# Altium project MainBoard.PrjPCB (part 1 of 2)
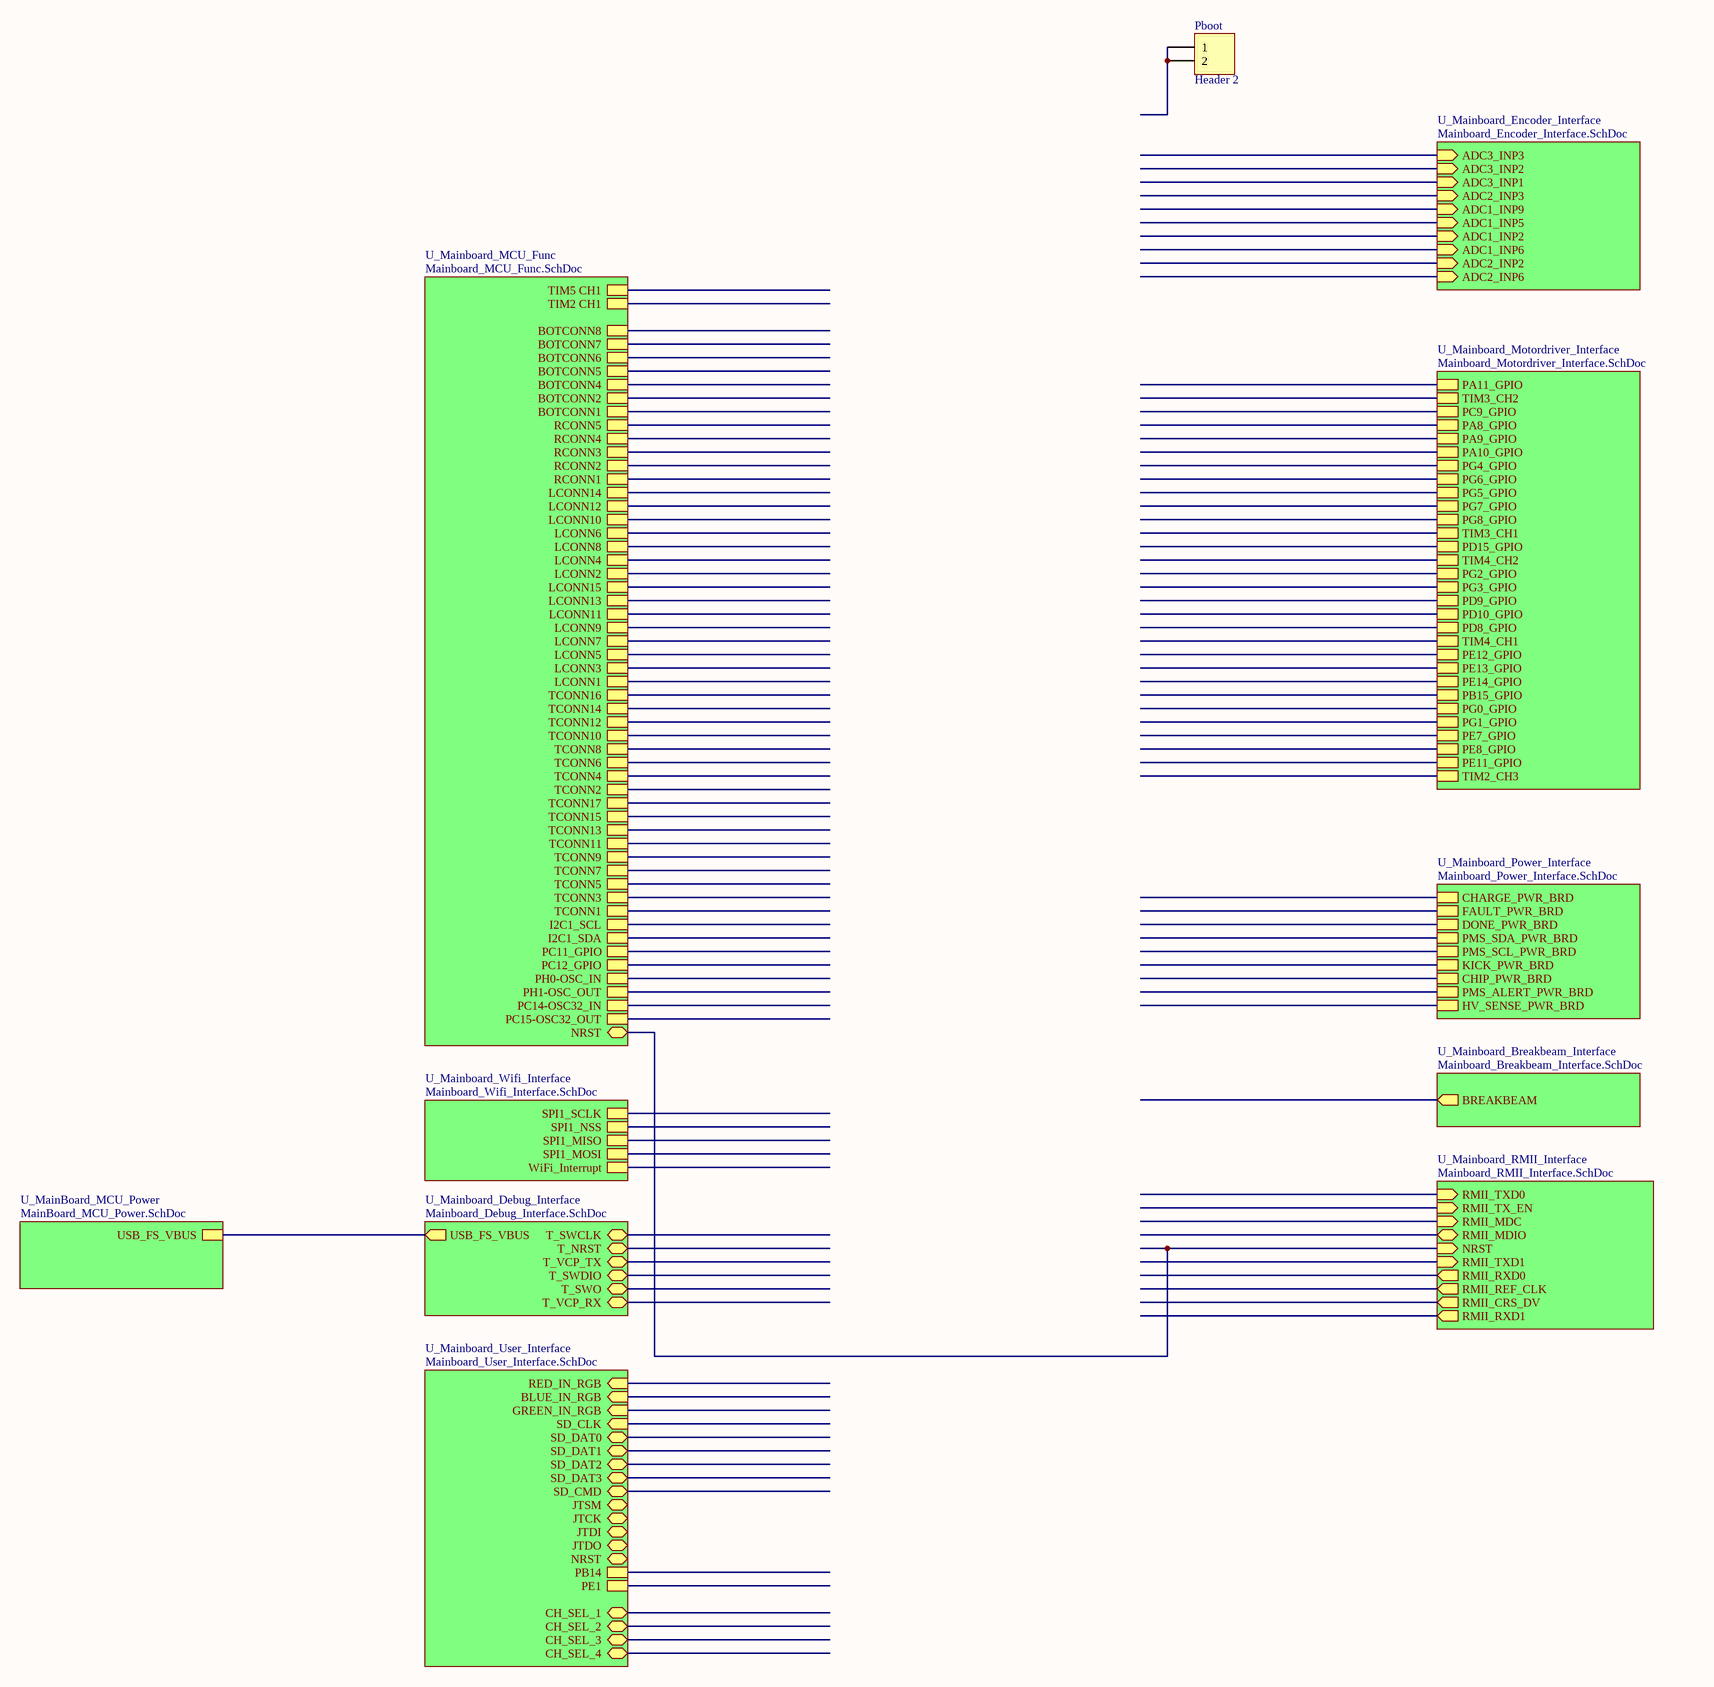
[diagram p0: MainBoard_Top.SchDoc]
12 sheets, 219 parts. Net scope: hierarchical (ports join the sheet entries above them; power ports are global).
Board file: MainBoard_Layout_V2.PcbDoc
Sheets:
  MainBoard_Top.SchDoc
    U_Mainboard_Encoder_Interface = Mainboard_Encoder_Interface.SchDoc
    U_Mainboard_MCU_Func = Mainboard_MCU_Func.SchDoc
    U_Mainboard_Motordriver_Interface = Mainboard_Motordriver_Interface.SchDoc
    U_Mainboard_Power_Interface = Mainboard_Power_Interface.SchDoc
    U_Mainboard_RMII_Interface = Mainboard_RMII_Interface.SchDoc
    U_Mainboard_Wifi_Interface = Mainboard_Wifi_Interface.SchDoc
    U_Mainboard_Breakbeam_Interface = Mainboard_Breakbeam_Interface.SchDoc
    U_MainBoard_MCU_Power = MainBoard_MCU_Power.SchDoc
    U_Mainboard_Debug_Interface = Mainboard_Debug_Interface.SchDoc
    U_Mainboard_User_Interface = Mainboard_User_Interface.SchDoc
  Mainboard_MCU_Breakout.SchDoc

## Sheet MainBoard_Top.SchDoc
size C

### Parts
Pboot  Header 2  [HDR1X2]

### Sub-sheets
U_Mainboard_Breakbeam_Interface = Mainboard_Breakbeam_Interface.SchDoc: BREAKBEAM (out)
U_Mainboard_Debug_Interface = Mainboard_Debug_Interface.SchDoc: USB_FS_VBUS (out), T_SWCLK (bidir), T_NRST (bidir), T_VCP_TX (bidir), T_SWDIO (bidir), T_SWO (bidir), T_VCP_RX (bidir)
U_Mainboard_Encoder_Interface = Mainboard_Encoder_Interface.SchDoc: ADC3_INP3 (in), ADC3_INP2 (in), ADC3_INP1 (in), ADC2_INP3 (in), ADC1_INP9 (in), ADC1_INP5 (in), ADC1_INP2 (in), ADC1_INP6 (in), ADC2_INP2 (in), ADC2_INP6 (in)
U_Mainboard_MCU_Func = Mainboard_MCU_Func.SchDoc: NRST (bidir), TIM5 CH1, TIM2 CH1, BOTCONN8, BOTCONN7, BOTCONN6, BOTCONN5, BOTCONN4, BOTCONN2, BOTCONN1, RCONN5, RCONN4, RCONN3, RCONN2, RCONN1, LCONN14, LCONN12, LCONN10, LCONN6, LCONN8, LCONN4, LCONN2, LCONN15, LCONN13, LCONN11, LCONN9, LCONN7, LCONN5, LCONN3, LCONN1, TCONN16, TCONN14, TCONN12, TCONN10, TCONN8, TCONN6, TCONN4, TCONN2, TCONN17, TCONN15, TCONN13, TCONN11, TCONN9, TCONN7, TCONN5, TCONN3, TCONN1, I2C1_SCL, I2C1_SDA, PC11_GPIO, PC12_GPIO, PH0-OSC_IN, PH1-OSC_OUT, PC14-OSC32_IN, PC15-OSC32_OUT
U_MainBoard_MCU_Power = MainBoard_MCU_Power.SchDoc: USB_FS_VBUS
U_Mainboard_Motordriver_Interface = Mainboard_Motordriver_Interface.SchDoc: PA11_GPIO, TIM3_CH2, PC9_GPIO, PA8_GPIO, PA9_GPIO, PA10_GPIO, PG4_GPIO, PG6_GPIO, PG5_GPIO, PG7_GPIO, PG8_GPIO, TIM3_CH1, PD15_GPIO, TIM4_CH2, PG2_GPIO, PG3_GPIO, PD9_GPIO, PD10_GPIO, PD8_GPIO, TIM4_CH1, PE12_GPIO, PE13_GPIO, PE14_GPIO, PB15_GPIO, PG0_GPIO, PG1_GPIO, PE7_GPIO, PE8_GPIO, PE11_GPIO, TIM2_CH3
U_Mainboard_Power_Interface = Mainboard_Power_Interface.SchDoc: CHARGE_PWR_BRD, FAULT_PWR_BRD, DONE_PWR_BRD, PMS_SDA_PWR_BRD, PMS_SCL_PWR_BRD, KICK_PWR_BRD, CHIP_PWR_BRD, PMS_ALERT_PWR_BRD, HV_SENSE_PWR_BRD
U_Mainboard_RMII_Interface = Mainboard_RMII_Interface.SchDoc: RMII_TXD0 (in), RMII_TX_EN (in), RMII_RXD0 (out), RMII_REF_CLK (out), RMII_CRS_DV (out), RMII_MDC (in), RMII_MDIO (bidir), NRST (in), RMII_TXD1 (in), RMII_RXD1 (out)
U_Mainboard_User_Interface = Mainboard_User_Interface.SchDoc: RED_IN_RGB (in), BLUE_IN_RGB (in), GREEN_IN_RGB (in), SD_CLK (in), SD_DAT0 (bidir), SD_DAT1 (bidir), SD_DAT2 (bidir), SD_DAT3 (bidir), SD_CMD (bidir), JTSM (bidir), JTCK (bidir), JTDI (bidir), JTDO (bidir), NRST (bidir), PB14, PE1, CH_SEL_1 (bidir), CH_SEL_2 (bidir), CH_SEL_3 (bidir), CH_SEL_4 (bidir)
U_Mainboard_Wifi_Interface = Mainboard_Wifi_Interface.SchDoc: SPI1_SCLK, SPI1_NSS, SPI1_MISO, SPI1_MOSI, WiFi_Interrupt

### Nets
NRST: sheet U_Mainboard_MCU_Func/NRST, sheet U_Mainboard_RMII_Interface/NRST
NetF1_1: sheet U_MainBoard_MCU_Power/USB_FS_VBUS, sheet U_Mainboard_Debug_Interface/USB_FS_VBUS
NetPboot_1: Pboot.1 Pboot.2

### Library data of the parts
Pboot = Header 2: Header, 2-Pin; LatestRevisionDate: 17-Jul-2002; LatestRevisionNote: Re-released for DXP Platform.; Publisher: Altium Limited

## Sheet Mainboard_Encoder_Interface.SchDoc
size 381 x 254 mm
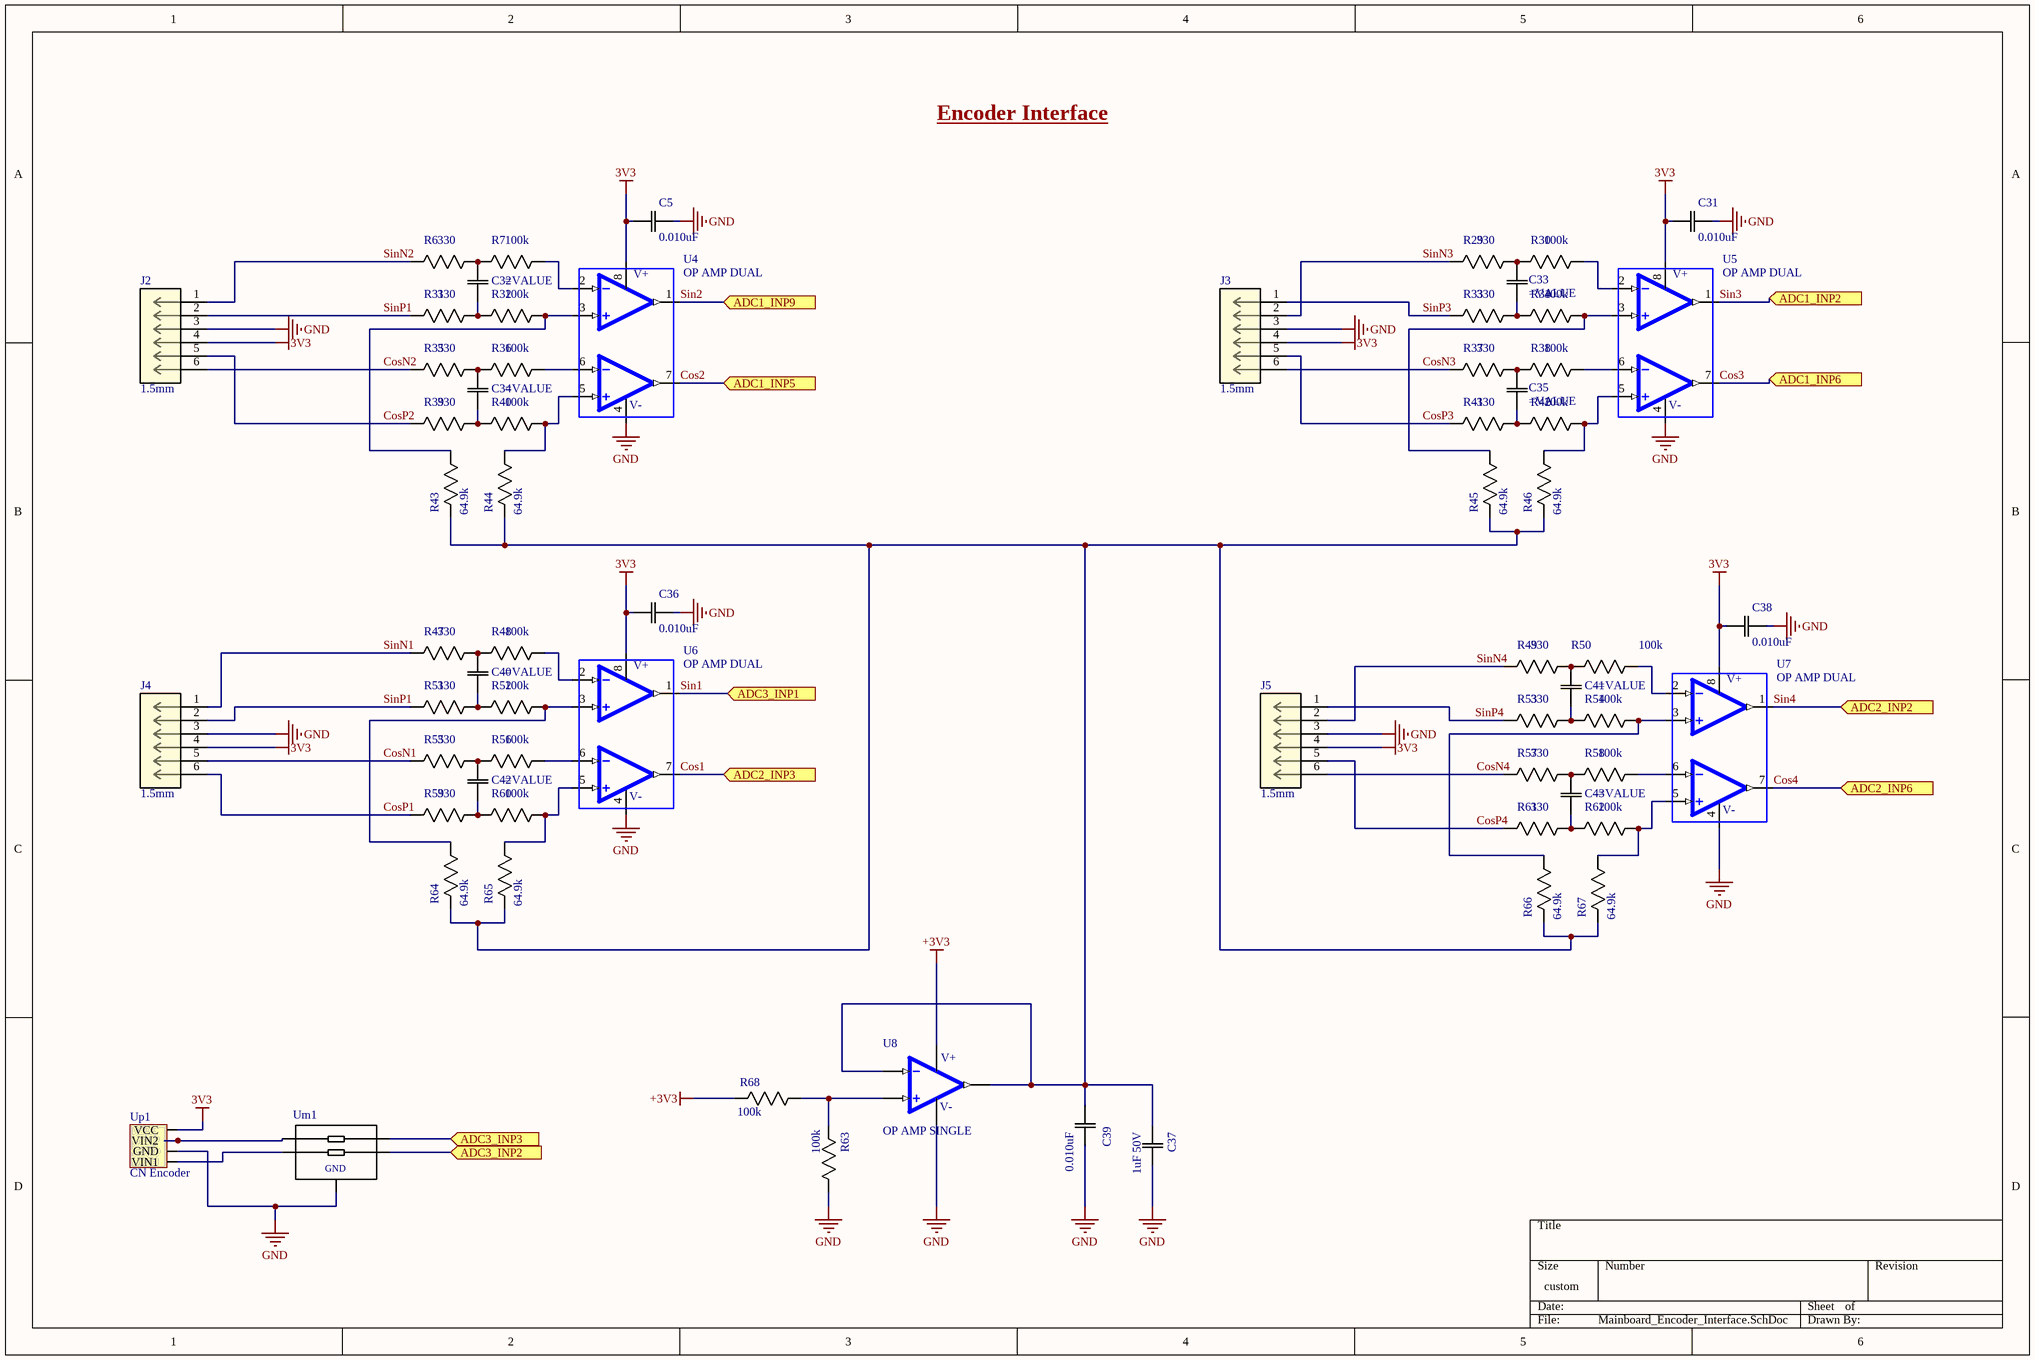
[diagram p1: Mainboard_Encoder_Interface.SchDoc]

### Parts
C5  0.010uF  [0603]
C31  0.010uF  [0603]
C32  (no value)
C33  (no value)
C34  (no value)
C35  (no value)
C36  0.010uF  [0603]
C37  1uF 50V  [0805]
C38  0.010uF  [0603]
C39  0.010uF  [0603]
C40  (no value)
C41  (no value)
C42  (no value)
C43  (no value)
J2  1.5mm  [6POS JST]
J3  1.5mm  [6POS JST]
J4  1.5mm  [6POS JST]
J5  1.5mm  [6POS JST]
R6  330  [0805]
R7  100k  [0805]
R29  330  [0805]
R30  100k  [0805]
R31  330  [0805]
R32  100k  [0805]
R33  330  [0805]
R34  100k  [0805]
R35  330  [0805]
R36  100k  [0805]
R37  330  [0805]
R38  100k  [0805]
R39  330  [0805]
R40  100k  [0805]
R41  330  [0805]
R42  100k  [0805]
R43  64.9k  [0805]
R44  64.9k  [0805]
R45  64.9k  [0805]
R46  64.9k  [0805]
R47  330  [0805]
R48  100k  [0805]
R49  330  [0805]
R50  100k  [0805]
R51  330  [0805]
R52  100k  [0805]
R53  330  [0805]
R54  100k  [0805]
R55  330  [0805]
R56  100k  [0805]
R57  330  [0805]
R58  100k  [0805]
R59  330  [0805]
R60  100k  [0805]
R61  330  [0805]
R62  100k  [0805]
R63  100k  [0805]
R64  64.9k  [0805]
R65  64.9k  [0805]
R66  64.9k  [0805]
R67  64.9k  [0805]
R68  100k  [0805]
U4  OP AMP DUAL  [8-MSOP]
U5  OP AMP DUAL  [8-MSOP]
U6  OP AMP DUAL  [8-MSOP]
U7  OP AMP DUAL  [8-MSOP]
U8  OP AMP SINGLE  [SOT95P280X145-5N]
Um1  EMI  [SOT-665]  (value not drawn)
Up1  CN Encoder  [EncoderConnector]

### Ports
ADC1_INP2 (in), ADC1_INP5 (in), ADC1_INP6 (in), ADC1_INP9 (in), ADC2_INP2 (in), ADC2_INP3 (in), ADC2_INP6 (in), ADC3_INP1 (in), ADC3_INP2 (in), ADC3_INP3 (in)

### Nets
3V3: C5.1(C1) C31.1(C1) C36.1(C1) C38.1(C1) J2.4 J3.4 J4.4 J5.4 U4.8(V+) U5.8(V+) U6.8(V+) U7.8(V+) Up1.VCC
+3V3: R68.2(R2) U8.5(V+)
GND: C5.2(C2) C31.2(C2) C36.2(C2) C37.2(C2) C38.2(C2) C39.2(C2) J2.3 J3.3 J4.3 J5.3 R63.1(R1) U4.4(V-) U5.4(V-) U6.4(V-) U7.4(V-) U8.2(V-) Um1.2(P$2) Up1.GND
Cos1: U6.7(OUTB) ; port ADC2_INP3
Cos2: U4.7(OUTB) ; port ADC1_INP5
Cos3: U5.7(OUTB) ; port ADC1_INP6
Cos4: U7.7(OUTB) ; port ADC2_INP6
CosN1: J4.5 R55.2(R2)
CosN2: J2.6 R35.2(R2)
CosN3: J3.6 R37.2(R2)
CosN4: J5.6 R57.2(R2)
CosP1: J4.6 R59.2(R2)
CosP2: J2.5 R39.2(R2)
CosP3: J3.5 R41.2(R2)
CosP4: J5.5 R61.2(R2)
Sin1: U6.1(OUTA) ; port ADC3_INP1
Sin2: U4.1(OUTA) ; port ADC1_INP9
Sin3: U5.1(OUTA) ; port ADC1_INP2
Sin4: U7.1(OUTA) ; port ADC2_INP2
SinN1: J4.1 R47.2(R2)
SinN2: J2.1 R6.2(R2)
SinN3: J3.2 R29.2(R2)
SinN4: J5.2 R49.2(R2)
SinP1: J2.2 J4.2 R31.2(R2) R51.2(R2)
SinP3: J3.1 R33.2(R2)
SinP4: J5.1 R53.2(R2)
NetC32_1: C32.1(C1) R31.1(R1) R32.2(R2)
NetC32_2: C32.2(C2) R6.1(R1) R7.2(R2)
NetC33_1: C33.1(C1) R33.1(R1) R34.2(R2)
NetC33_2: C33.2(C2) R29.1(R1) R30.2(R2)
NetC34_1: C34.1(C1) R39.1(R1) R40.2(R2)
NetC34_2: C34.2(C2) R35.1(R1) R36.2(R2)
NetC35_1: C35.1(C1) R41.1(R1) R42.2(R2)
NetC35_2: C35.2(C2) R37.1(R1) R38.2(R2)
NetC37_1: C37.1(C1) C39.1(C1) R43.2(R2) R44.2(R2) R45.2(R2) R46.2(R2) R64.2(R2) R65.2(R2) R66.2(R2) R67.2(R2) U8.1(OUT) U8.4(IN-)
NetC40_1: C40.1(C1) R51.1(R1) R52.2(R2)
NetC40_2: C40.2(C2) R47.1(R1) R48.2(R2)
NetC41_1: C41.1(C1) R53.1(R1) R54.2(R2)
NetC41_2: C41.2(C2) R49.1(R1) R50.2(R2)
NetC42_1: C42.1(C1) R59.1(R1) R60.2(R2)
NetC42_2: C42.2(C2) R55.1(R1) R56.2(R2)
NetC43_1: C43.1(C1) R61.1(R1) R62.2(R2)
NetC43_2: C43.2(C2) R57.1(R1) R58.2(R2)
NetR7_1: R7.1(R1) U4.2(INA-)
NetR30_1: R30.1(R1) U5.2(INA-)
NetR32_1: R32.1(R1) R43.1(R1) U4.3(INA+)
NetR34_1: R34.1(R1) R45.1(R1) U5.3(INA+)
NetR36_1: R36.1(R1) U4.6(INB-)
NetR38_1: R38.1(R1) U5.6(INB-)
NetR40_1: R40.1(R1) R44.1(R1) U4.5(INB+)
NetR42_1: R42.1(R1) R46.1(R1) U5.5(INB+)
NetR48_1: R48.1(R1) U6.2(INA-)
NetR50_1: R50.1(R1) U7.2(INA-)
NetR52_1: R52.1(R1) R64.1(R1) U6.3(INA+)
NetR54_1: R54.1(R1) R66.1(R1) U7.3(INA+)
NetR56_1: R56.1(R1) U6.6(INB-)
NetR58_1: R58.1(R1) U7.6(INB-)
NetR60_1: R60.1(R1) R65.1(R1) U6.5(INB+)
NetR62_1: R62.1(R1) R67.1(R1) U7.5(INB+)
NetR63_2: R63.2(R2) R68.1(R1) U8.3(IN+)
NetUm1_1: Um1.1(P$1) Up1.VIN2
NetUm1_3: Um1.3(P$3) Up1.VIN1
NetUm1_4: Um1.4(P$4) ; port ADC3_INP2
NetUm1_5: Um1.5(P$5) ; port ADC3_INP3

### Notes on the sheet
- Encoder Interface
- (in symbol EMI FILTER IP4256CZ5-W) GND

### Library data of the parts
C5 C31 C36 C38 C39 = CAP 0.010uF 50V: CAP CER 0.010UF 50V X7R 0603/0805; Tolerance: 10%; Package: 0603/0805; Value: 0.010uF; Rating: 50V; Temperature Coefficient: X7R; Operating Temperature: -55°C ~ 125°C
C32-C35 C40-C43 = CAPACITOR_SCH
C37 = CAP 1uF 50V: CAP CER 1UF 50V X7R 0805; Tolerance: 10%; Package: 0805; Value: 1uF; Rating: 50V; Temperature Coefficient: X7R; Operating Temperature: -55°C ~ 125°C
J2-J5 = CN 6POS JST RA: Conn Shrouded Header HDR 6 POS 1.5mm Solder RA Thru-Hole Box; Manufacturer: JST; Manufacturer Part Number: S6B-ZR(LF)(SN); Body Plating: Tin; Number of Positions: 6; Current Rating: 1A; Connector Type: Header,Male Pin; Contact Resistance: 30mR; Voltage Rating: 50V; Gender: Male; Insulation Resistance: 500MR; Panel Thickness: 3.5mm; Supplier 1: Digi-Key; RoHS: Yes; Category: Headers and Wire Housings; Stock 1: 14808; Mount: Through Hole; Number of Pins: 6; Color: White; Contact Plating: Tin,Copper; Contact Material: Brass,Tin,Copper; Housing Color: Beige; Housing Material: Polyamide; Material: Nylon; Contact Shape: Circular; Insulation Material: Nylon; Insulation Color: Natural; Min Operating Temperature: -25°C; Max Operating Temperature: 85°C; Number of Rows: 1; Packaging: Bulk; Termination: Solder; Fastening Type: Detent; Number of Contacts: 6; Max Voltage Rating (AC): 50V; Max Current Rating: 1A; Orientation: Right Angle; Voltage Rating (AC): 50V; Voltage Rating (DC): 50V; Length: 10.5mm; Width: 3.5mm; Height: 7.2mm; Pitch: 1.5mm; Depth: 6mm; Lead Pitch: 1.5mm; Contact Mating Length: 0.094inch; Lead Free: Lead Free; Flammability Rating: UL94 V-0; REACH SVHC: No SVHC; ComponentLink1URL: https://datasheet.ciiva.com/8052/80556-8052225.pdf?src-supplier=Element14; ComponentLink1Description: https://datasheet.ciiva.com/8052/80556-8052225.pdf?src-supplier=Element14; ComponentLink2URL: https://datasheet.ciiva.com/25617/0900766b81147f94-25617345.pdf?src-supplier=RSComponents; ComponentLink2Description: https://datasheet.ciiva.com/25617/0900766b81147f94-25617345.pdf?src-supplier=RSComponents; ComponentLink3URL: https://datasheet.ciiva.com/11752/0900766b8082f593-11752194.pdf?src-supplier=RSComponents; ComponentLink3Description: https://datasheet.ciiva.com/11752/0900766b8082f593-11752194.pdf?src-supplier=RSComponents; ComponentLink4URL: https://datasheet.ciiva.com/26894/getdatasheetpartid-642095-26894637.pdf?src-supplier=Verical; ComponentLink4Description: https://datasheet.ciiva.com/26894/getdatasheetpartid-642095-26894637.pdf?src-supplier=Verical; ComponentLink5URL: https://datasheet.ciiva.com/712/ezh-712560.pdf?src-supplier=Digi-Key; ComponentLink5Description: https://datasheet.ciiva.com/712/ezh-712560.pdf?src-supplier=Digi-Key; ComponentLink6URL: https://datasheet.ciiva.com/16484/s6b-zrlfsn-16484554.pdf?src-supplier=Future+Electronics; ComponentLink6Description: https://datasheet.ciiva.com/16484/s6b-zrlfsn-16484554.pdf?src-supplier=Future+Electronics; Supplier Part Number 1: 455-1673-ND
R6 R29 R31 R33 R35 R37 R39 R41 R47 R49 R51 R53 R55 R57 R59 R61 = RES 330.0 1/8W - 1%: RES SMD 330 OHM 1% 1/8W 0805; Rating: 0.125W; Package: 0805; Value: 330; Tolerance: 1%
R7 R30 R32 R34 R36 R38 R40 R42 R48 R50 R52 R54 R56 R58 R60 R62 R63 R68 = RES 100k 1/8W - 1%: RES SMD 100K OHM 1% 1/8W 0805; Power (Watts): 0.125W; Package: 0805; Value: 100k; Tolerance: 1%
R43-R46 R64-R67 = RES 64.9k 1/8W: RES SMD 64.9K OHM 1% 1/8W 0805; Power (Watts): 0.125W; Package: 0805; Value: 64.9k; Tolerance: 1%; ComponentLink1Description: digikey; ComponentLink1URL: https://www.digikey.ca/en/products/detail/yageo/RC0805FR-0764K9L/728090
U4-U7 = OP AMP DUAL: IC OPAMP VFB 50KHZ RRO 8MSOP; Manufacturer: Analog Devices; Manufacturer Part Number: ADA4505-2ARMZ; Common Mode Rejection Ratio: 105dB; Max Supply Voltage: 5V; Min Supply Voltage: 1.8V; Max Dual Supply Voltage: 2.5V; Min Dual Supply Voltage: 900mV; Voltage Gain: 120dB; Operating Supply Voltage: 3V; Slew Rate: 0.006V/µs; Input Offset Voltage (Vos): 3mV; Input Bias Current: 0.5pA; Operating Supply Current: 14uA; Number of Channels: 2; Power Supply Rejection Ratio (PSRR): 110dB; Output Current per Channel: 40mA; Quiescent Current: 7uA; Input Capacitance: 4.7pF; Supply Type: Single,Dual; Supplier 1: Digi-Key; RoHS: Yes; Category: Amplifiers - Op Amps, Buffer, Instrumentation; Stock 1: 767; Case/Package: MSOP; Number of Pins: 8; Contact Plating: Tin,Matte; Min Operating Temperature: -40°C; Max Operating Temperature: 125°C; Gain Bandwidth Product: 50kHz; Packaging: Rail/Tube; Package Quantity: 50; Unity Gain Bandwidth Product: 50kHz; Number of Circuits: 2; Number of Elements: 2; Number of Amplifiers: 2; Max Input Voltage: 5V; Nominal Supply Current: 7uA; Bandwidth: 50kHz; Length: 3.2mm; Width: 3.2mm; Height: 0.95mm; Lead Free: Contains Lead; REACH SVHC: No SVHC; ComponentLink1URL: https://datasheet.ciiva.com/24017/ada4505-1-4505-2-4505-4-249280-24017665.pdf?src-supplier=Mouser; ComponentLink1Description: https://datasheet.ciiva.com/24017/ada4505-1-4505-2-4505-4-249280-24017665.pdf?src-supplier=Mouser; ComponentLink2URL: https://datasheet.ciiva.com/2974/ada4505-1-4505-2-4505-4-2974772.pdf?src-supplier=Avnet; ComponentLink2Description: https://datasheet.ciiva.com/2974/ada4505-1-4505-2-4505-4-2974772.pdf?src-supplier=Avnet; ComponentLink3URL: https://datasheet.ciiva.com/17569/ada4505-1-4505-2-4505-4-17569270.pdf?src-supplier=Avnet+Europe; ComponentLink3Description: https://datasheet.ciiva.com/17569/ada4505-1-4505-2-4505-4-17569270.pdf?src-supplier=Avnet+Europe; ComponentLink4URL: https://datasheet.ciiva.com/1805/ada4505-1-4505-2-4505-4-1805784.pdf?src-supplier=Digi-Key; ComponentLink4Description: https://datasheet.ciiva.com/1805/ada4505-1-4505-2-4505-4-1805784.pdf?src-supplier=Digi-Key; Supplier Part Number 1: ADA4505-2ARMZ-ND
U8 = OP AMP SINGLE: ANALOG DEVICES - ADA4505-1ARJZ-R7 - IC, AMPLIF. OPER., R-R, CMOS, SOT23-5; Min Supply Voltage: 1.8V; Max Supply Voltage: 5V; Min Dual Supply Voltage: 900mV; Max Dual Supply Voltage: 2.5V; Voltage Gain: 120dB; Common Mode Rejection Ratio: 105dB; Gain Bandwidth Product: 50kHz; Slew Rate: 0.006V/µs; Operating Supply Voltage: 3V; Number of Circuits: 1; Input Bias Current: 500nA; Input Offset Voltage (Vos): 3mV; Operating Supply Current: 9uA; Output Current per Channel: 40mA; Power Supply Rejection Ratio (PSRR): 110dB; Input Capacitance: 4.7pF; Supplier 1: Digi-Key; Manufacturer: Analog Devices; Manufacturer Part Number: ADA4505-1ARJZ-R7; RoHS: Yes; Category: Amplifiers - Op Amps, Buffer, Instrumentation; Stock 1: 3416; Case/Package: SOT-23-5; Number of Pins: 5; Contact Plating: Tin,Matte; Min Operating Temperature: -40°C; Max Operating Temperature: 125°C; Bandwidth: 50kHz; Packaging: Tape and Reel; Package Quantity: 3000; Unity Gain Bandwidth Product: 50kHz; Number of Channels: 1; Number of Elements: 1; Number of Amplifiers: 1; Quiescent Current: 9uA; REACH SVHC: No SVHC; Lead Free: Contains Lead; ComponentLink1URL: https://datasheet.ciiva.com/22712/1610797-22712032.pdf?src-supplier=Element14; ComponentLink1Description: https://datasheet.ciiva.com/22712/1610797-22712032.pdf?src-supplier=Element14; ComponentLink2URL: https://datasheet.ciiva.com/23805/608874-23805844.pdf?src-supplier=Newark; ComponentLink2Description: https://datasheet.ciiva.com/23805/608874-23805844.pdf?src-supplier=Newark; ComponentLink3URL: https://datasheet.ciiva.com/1487/1610797-1487372.pdf?src-supplier=Element14; ComponentLink3Description: https://datasheet.ciiva.com/1487/1610797-1487372.pdf?src-supplier=Element14; Supplier Part Number 1: ADA4505-1ARJZ-R7CT-ND
Um1 = EMI FILTER IP4256CZ5-W: FILTER RC(PI) 100 OHM/19PF SMD; MF: Nexperia USA Inc.; MP: IP4256CZ5-W,115; SnapEDA_Link: https://www.snapeda.com/parts/IP4256CZ5-W/Nexperia%20USA%20Inc./view-part/3605439/?ref=snap; Price: 0.17 CAD; Package: SOT-665; Digikey: 1727-4718-1-ND; Digikey Link: https://www.digikey.ca/product-detail/en/nexperia-usa-inc/IP4256CZ5-W115/1727-4718-1-ND/2531158; Supplier 1: Digi-Key; Supplier Part Number 1: 1727-4718-1-ND
Up1 = CN HDR 4POS: CN HDR R/A 4POS 1.5MM; MF: JST Sales America Inc.; MP: S4B-ZR(LF)(SN); Rating: 1A; Digikey: 455-1671-ND; Digikey Link: https://www.digikey.ca/products/en?keywords=455-1671-ND; Price: 0.324 CAD; Package: N/A; Value: N/A; Supplier 1: Digi-Key; Supplier Part Number 1: 455-1671-ND

## Sheet Mainboard_MCU_Func.SchDoc
size A4
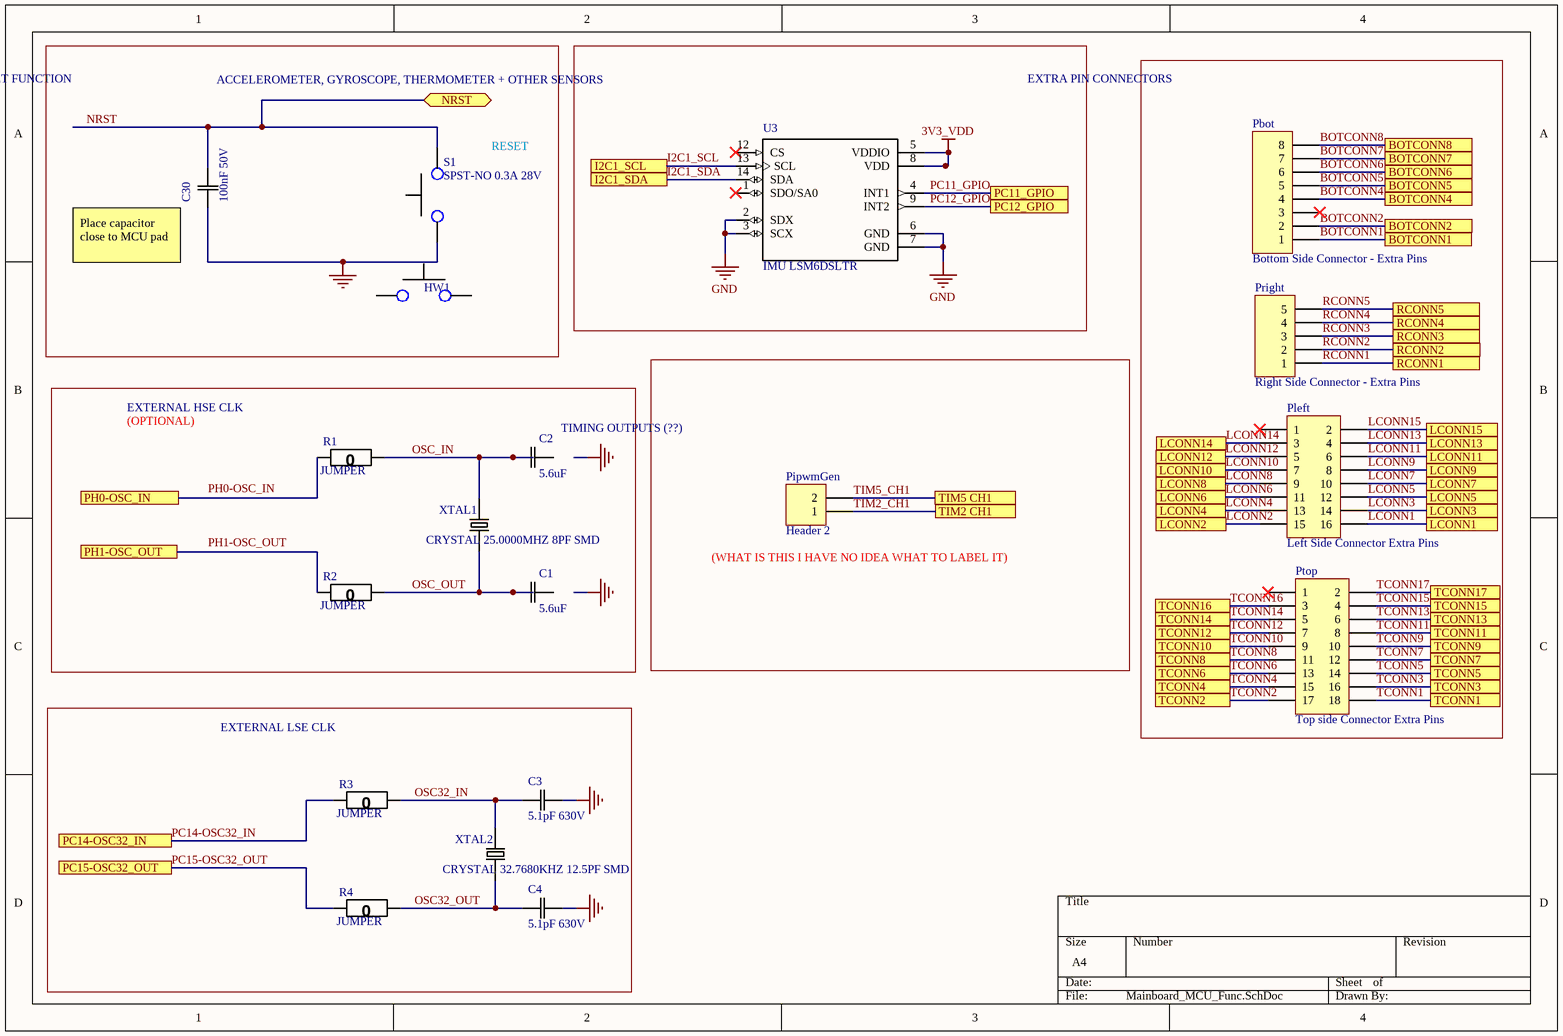
[diagram p2: Mainboard_MCU_Func.SchDoc]

### Parts
(Parts that share a designator on the sheet are numbered #1, #2 ... from top to bottom, then left to right.)
C1#1  5.6uF  [0805]
C2#1  5.6uF  [0805]
C3#1  5.1pF 630V  [0805]
C4#1  5.1pF 630V  [0805]
C30#1  100nF 50V  [0805]
HW1  SPST-NO 0.3A 28V  [PB300STQ]  (value not drawn)
Pbot  Bottom Side Connector - Extra Pins  [HDR1X8]
PipwmGen  Header 2  [HDR1X2]
Pleft  Left Side Connector Extra Pins  [HDR2X8]
Pright  Right Side Connector - Extra Pins  [HDR1X5]
Ptop  Top side Connector Extra Pins  [HDR2X9]
R1#1  JUMPER  [0805]
R2#1  JUMPER  [0805]
R3#1  JUMPER  [0805]
R4#1  JUMPER  [0805]
S1  SPST-NO 0.3A 28V  [PB300STQ]
U3#1  IMU LSM6DSLTR  [LGA-14]
XTAL1#1  CRYSTAL 25.0000MHZ 8PF SMD  [SMD-2]
XTAL2  CRYSTAL 32.7680KHZ 12.5PF SMD  [SMD-2]

### Blocks framed on the sheet
ACCELEROMETER, GYROSCOPE, THERMOMETER + OTHER SENSORS: U3#1
EXTRA PIN CONNECTORS: Pbot Pleft Pright Ptop
EXTERNAL LSE CLK: C3#1 C4#1 R3#1 R4#1 XTAL2

### Ports
BOTCONN1, BOTCONN2, BOTCONN4, BOTCONN5, BOTCONN6, BOTCONN7, BOTCONN8, I2C1_SCL, I2C1_SDA, LCONN1, LCONN2, LCONN3, LCONN4, LCONN5, LCONN6, LCONN7, LCONN8, LCONN9, LCONN10, LCONN11, LCONN12, LCONN13, LCONN14, LCONN15, NRST (bidir), PC11_GPIO, PC12_GPIO, PC14-OSC32_IN, PC15-OSC32_OUT, PH0-OSC_IN, PH1-OSC_OUT, RCONN1, RCONN2, RCONN3, RCONN4, RCONN5, TCONN1, TCONN2, TCONN3, TCONN4, TCONN5, TCONN6, TCONN7, TCONN8, TCONN9, TCONN10, TCONN11, TCONN12, TCONN13, TCONN14, TCONN15, TCONN16, TCONN17, TIM2 CH1, TIM5 CH1

### Nets
3V3_VDD: U3#1.5(VDDIO) U3#1.8(VDD)
GND: C3#1.2(C2) C4#1.2(C2) C30#1.1(C1) S1.1 U3#1.2(SDX) U3#1.3(SCX) U3#1.6(GND) U3#1.7(GND)
BOTCONN1: Pbot.1 ; port BOTCONN1
BOTCONN2: Pbot.2 ; port BOTCONN2
BOTCONN4: Pbot.4 ; port BOTCONN4
BOTCONN5: Pbot.5 ; port BOTCONN5
BOTCONN6: Pbot.6 ; port BOTCONN6
BOTCONN7: Pbot.7 ; port BOTCONN7
BOTCONN8: Pbot.8 ; port BOTCONN8
I2C1_SCL: U3#1.13(SCL) ; port I2C1_SCL
I2C1_SDA: U3#1.14(SDA) ; port I2C1_SDA
LCONN1: Pleft.16 ; port LCONN1
LCONN2: Pleft.15 ; port LCONN2
LCONN3: Pleft.14 ; port LCONN3
LCONN4: Pleft.13 ; port LCONN4
LCONN5: Pleft.12 ; port LCONN5
LCONN6: Pleft.11 ; port LCONN6
LCONN7: Pleft.10 ; port LCONN7
LCONN8: Pleft.9 ; port LCONN8
LCONN9: Pleft.8 ; port LCONN9
LCONN10: Pleft.7 ; port LCONN10
LCONN11: Pleft.6 ; port LCONN11
LCONN12: Pleft.5 ; port LCONN12
LCONN13: Pleft.4 ; port LCONN13
LCONN14: Pleft.3 ; port LCONN14
LCONN15: Pleft.2 ; port LCONN15
NRST: C30#1.2(C2) S1.2 ; port NRST
OSC32_IN: C3#1.1(C1) R3#1.1(R1) XTAL2.2
OSC32_OUT: C4#1.1(C1) R4#1.1(R1) XTAL2.1
OSC_IN: C2#1.1(C1) R1#1.1(R1) XTAL1#1.2
OSC_OUT: C1#1.1(C1) R2#1.1(R1) XTAL1#1.1
PC11_GPIO: U3#1.4(INT1) ; port PC11_GPIO
PC12_GPIO: U3#1.9(INT2) ; port PC12_GPIO
PC14-OSC32_IN: R3#1.2(R2) ; port PC14-OSC32_IN
PC15-OSC32_OUT: R4#1.2(R2) ; port PC15-OSC32_OUT
RCONN1: Pright.1 ; port RCONN1
RCONN2: Pright.2 ; port RCONN2
RCONN3: Pright.3 ; port RCONN3
RCONN4: Pright.4 ; port RCONN4
RCONN5: Pright.5 ; port RCONN5
TCONN1: Ptop.18 ; port TCONN1
TCONN2: Ptop.17 ; port TCONN2
TCONN3: Ptop.16 ; port TCONN3
TCONN4: Ptop.15 ; port TCONN4
TCONN5: Ptop.14 ; port TCONN5
TCONN6: Ptop.13 ; port TCONN6
TCONN7: Ptop.12 ; port TCONN7
TCONN8: Ptop.11 ; port TCONN8
TCONN9: Ptop.10 ; port TCONN9
TCONN10: Ptop.9 ; port TCONN10
TCONN11: Ptop.8 ; port TCONN11
TCONN12: Ptop.7 ; port TCONN12
TCONN13: Ptop.6 ; port TCONN13
TCONN14: Ptop.5 ; port TCONN14
TCONN15: Ptop.4 ; port TCONN15
TCONN16: Ptop.3 ; port TCONN16
TCONN17: Ptop.2 ; port TCONN17
TIM2_CH1: PipwmGen.1 ; port TIM2 CH1
TIM5_CH1: PipwmGen.2 ; port TIM5 CH1
NetR1#1_2: R1#1.2(R2) ; port PH0-OSC_IN
NetR2#1_2: R2#1.2(R2) ; port PH1-OSC_OUT

Not connected (* = marked no-connect by the designer): C1#1 2(C2); C2#1 2(C2); HW1 1 2; Pbot 3*; Pleft 1*; Ptop 1*; U3#1 1(SDO/SA0)* 12(CS)*

### Notes on the sheet
- RESET FUNCTION
- RESET
- (near C30#1) Place capacitor close to MCU pad
- EXTERNAL HSE CLK
- (OPTIONAL)
- TIMING OUTPUTS (??)
- (near PipwmGen) (WHAT IS THIS I HAVE NO IDEA WHAT TO LABEL IT)
- Labels drawn without touching a wire or pin: PH0-OSC_IN, PH1-OSC_OUT

### Library data of the parts
C1#1 C2#1 = CAP 5.6uF 6.3V: CAP CER 5.6UF 6.3V X5R 0805; Tolerance: 10%; Package: 0805; Value: 5.6uF; Rating: 6.3V; Temperature Coefficient: X5R; Operating Temperature: -55°C ~ 85°C
C3#1 C4#1 = CAP 5.1pF 630V: CAP CER 5.1PF 630V C0G/NP0 0805; Tolerance: 10%; Rating: 50V; Package: 0805; Value: 5.1pF; Temperature Coefficient: C0G/NP0; Operating Temperature: -55°C ~ 125°C
C30#1 = CAP 100nF 50V: CAP CER 0.1UF 50V X7R 0805; Tolerance: 10%; Package: 0805; Value: 100nF; Rating: 50V
HW1 S1 = SW PUSH NO: Pushbutton Switch SPST-NO Standard Through Hole; MF: E-Switch; Rating: 28V 0.3A; ComponentLink1Description: Digikey; ComponentLink1URL: https://www.digikey.ca/product-detail/en/e-switch/PB300STQ/EG5398-ND/6126493; ComponentLink2Description: Datasheet; ComponentLink2URL: https://sten-eswitch-13110800-production.s3.amazonaws.com/system/asset/product_line/data_sheet/222/PB300.pdf; Digikey: EG5398-ND; Digikey Link: https://www.digikey.ca/product-detail/en/e-switch/PB300STQ/EG5398-ND/6126493; MP: PB300STQ; Price: 3.40000 CAD
Pbot = Header 8: Header, 8-Pin; LatestRevisionDate: 17-Jul-2002; LatestRevisionNote: Re-released for DXP Platform.; Publisher: Altium Limited
PipwmGen = Header 2: Header, 2-Pin; LatestRevisionDate: 17-Jul-2002; LatestRevisionNote: Re-released for DXP Platform.; Publisher: Altium Limited
Pleft = Header 8X2: Header, 8-Pin, Dual row; LatestRevisionDate: 17-Jul-2002; LatestRevisionNote: Re-released for DXP Platform.; Publisher: Altium Limited
Pright = Header 5: Header, 5-Pin; LatestRevisionDate: 17-Jul-2002; LatestRevisionNote: Re-released for DXP Platform.; Publisher: Altium Limited
Ptop = Header 9X2: Header, 9-Pin, Dual row; LatestRevisionDate: 17-Jul-2002; LatestRevisionNote: Re-released for DXP Platform.; Publisher: Altium Limited
R1#1 R2#1 R3#1 R4#1 = RES 0 JUMPER: RES SMD 0 OHM JUMPER GENERIC 0805; Value: 0; Package: 0805
U3#1 = IMU LSM6DSLTR: IMU ACCEL/GYRO I2C/SPI 14LGA; MF: STMicroelectronics; SnapEDA_Link: https://www.snapeda.com/parts/LSM6DSLTR/STMicroelectronics/view-part/550517/?ref=snap; MP: LSM6DSLTR; Package: LGA-14 STMicroelectronics; Digikey: https://www.digikey.ca/product-detail/en/stmicroelectronics/LSM6DSLTR/497-16705-1-ND/6192805; Supplier 1: Digi-Key; Supplier Part Number 1: 497-16705-1-ND
XTAL1#1 = XTAL 25MHZ 8PF SMD: 25MHz ±50ppm Crystal 8pF 70 Ohms 2-SMD, No Lead; MP: NX5032GA-25.000000MHZ-LN-CD-1; MF: NDK America, Inc.; ESR: 70 Ohms; Package: 2-SMD, No Lead; Price: 0.95 CAD; Frequency: 25MHz; Digikey: 644-1041-1-ND; Digikey Link: https://www.digikey.ca/product-detail/en/ndk-america-inc/NX5032GA-25.000000MHZ-LN-CD-1/644-1041-1-ND/1128913; Load Capacitance: 8pF; Supplier 1: Digi-Key; Supplier Part Number 1: 644-1041-1-ND
XTAL2 = XTAL 32.7680KHZ 12.5PF SMD: 32.768kHz ±20ppm Crystal 12.5pF 70 kOhms 2-SMD, No Lead; MP: NX3215SA-32.768K-STD-MUA-8; MF: NDK America, Inc.; Package: 2-SMD, No Lead; Price: 1.04000 CAD; Frequency: 32.768kHz; Digikey: 644-1156-1-ND; Digikey Link: https://www.digikey.ca/en/products/detail/ndk-america-inc/NX3215SA-32-768K-STD-MUA-8/2261469?s=N4IgTCBcDaIGwBYEFoCMqCsc3IHIBEQBdAXyA; Load Capacitance: 12.5pF; ESR: 70 kOhms; ComponentLink1Description: Digikey; ComponentLink1URL: https://www.digikey.ca/en/products/detail/ndk-america-inc/NX3215SA-32-768K-STD-MUA-8/2261469; ComponentLink2Description: Datasheet; ComponentLink2URL: https://media.digikey.com/datasheets/production/702868/1/NX3215SA-32-768K-STD-MUA-8.html; Supplier 1: Digi-Key; Supplier Part Number 1: 644-1156-1-ND

## Sheet Mainboard_Motordriver_Interface.SchDoc
size A4
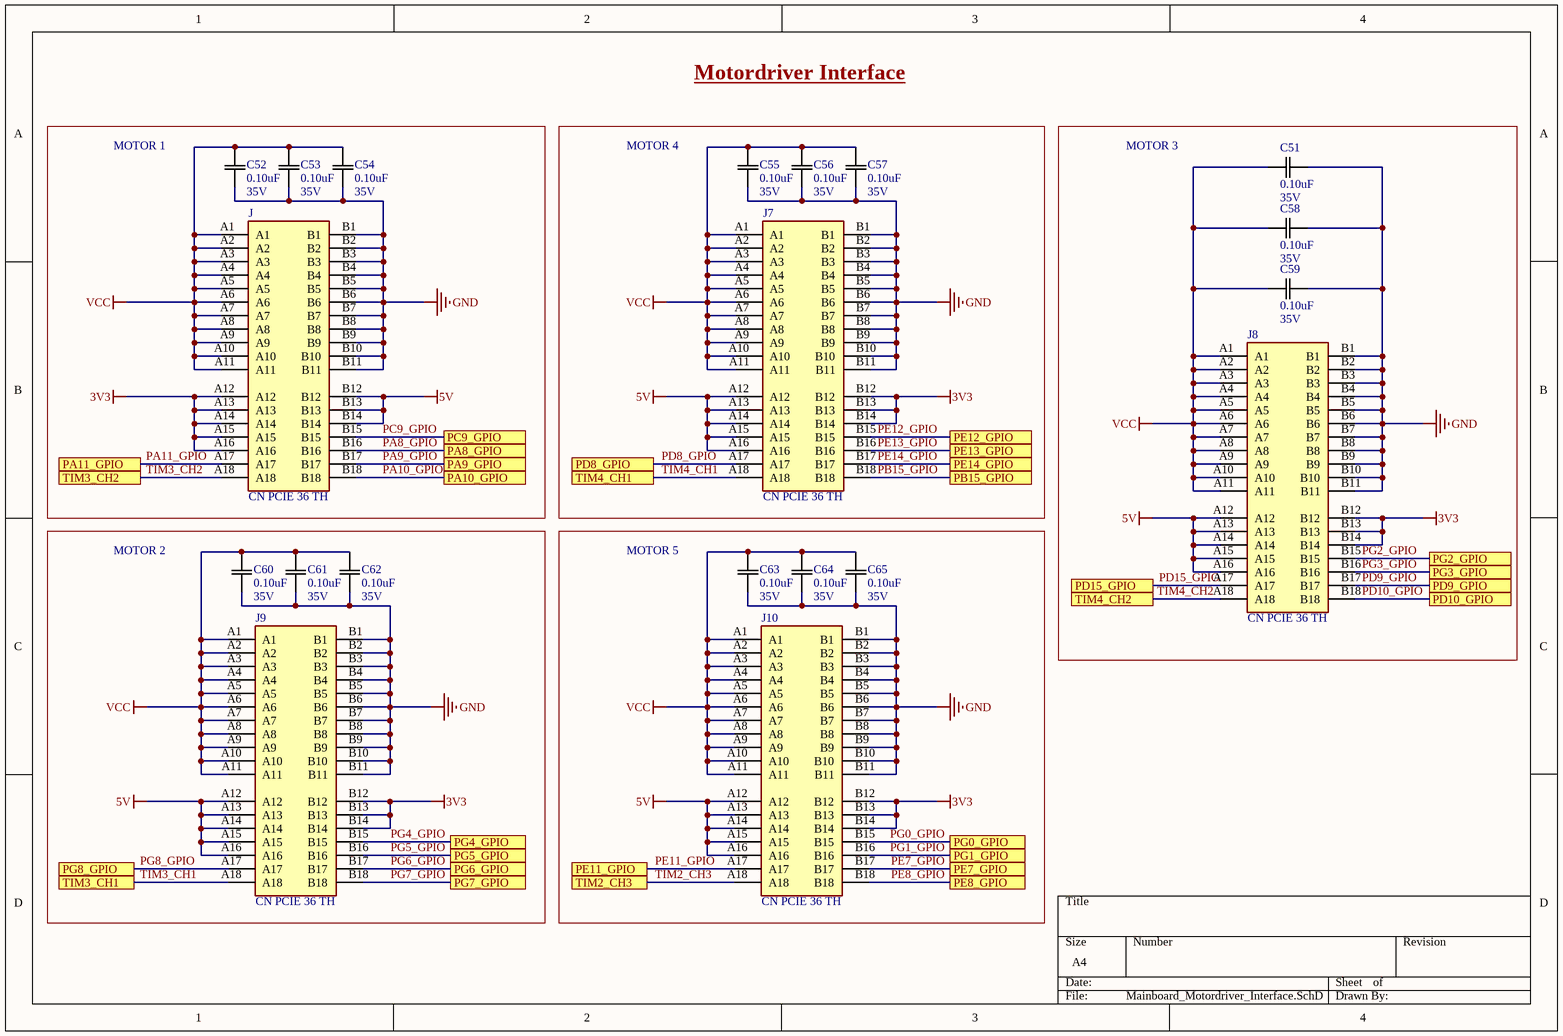
[diagram p3: Mainboard_Motordriver_Interface.SchDoc]

### Parts
C51  Rating: 35V  [0603]  (hidden comment: 0.10uF)
C52  Rating: 35V  [0603]  (hidden comment: 0.10uF)
C53  Rating: 35V  [0603]  (hidden comment: 0.10uF)
C54  Rating: 35V  [0603]  (hidden comment: 0.10uF)
C55  Rating: 35V  [0603]  (hidden comment: 0.10uF)
C56  Rating: 35V  [0603]  (hidden comment: 0.10uF)
C57  Rating: 35V  [0603]  (hidden comment: 0.10uF)
C58  Rating: 35V  [0603]  (hidden comment: 0.10uF)
C59  Rating: 35V  [0603]  (hidden comment: 0.10uF)
C60  Rating: 35V  [0603]  (hidden comment: 0.10uF)
C61  Rating: 35V  [0603]  (hidden comment: 0.10uF)
C62  Rating: 35V  [0603]  (hidden comment: 0.10uF)
C63  Rating: 35V  [0603]  (hidden comment: 0.10uF)
C64  Rating: 35V  [0603]  (hidden comment: 0.10uF)
C65  Rating: 35V  [0603]  (hidden comment: 0.10uF)
J  CN PCIE 36 TH  [CN PCIE 36 TH]
J7  CN PCIE 36 TH  [CN PCIE 36 TH]
J8  CN PCIE 36 TH  [CN PCIE 36 TH]
J9  CN PCIE 36 TH  [CN PCIE 36 TH]
J10  CN PCIE 36 TH  [CN PCIE 36 TH]

### Blocks framed on the sheet
MOTOR 1: C52-C54 J
MOTOR 4: C55-C57 J7
MOTOR 3: C51 C58 C59 J8
MOTOR 2: C60-C62 J9
MOTOR 5: C63-C65 J10

### Ports
PA8_GPIO, PA9_GPIO, PA10_GPIO, PA11_GPIO, PB15_GPIO, PC9_GPIO, PD8_GPIO, PD9_GPIO, PD10_GPIO, PD15_GPIO, PE7_GPIO, PE8_GPIO, PE11_GPIO, PE12_GPIO, PE13_GPIO, PE14_GPIO, PG0_GPIO, PG1_GPIO, PG2_GPIO, PG3_GPIO, PG4_GPIO, PG5_GPIO, PG6_GPIO, PG7_GPIO, PG8_GPIO, TIM2_CH3, TIM3_CH1, TIM3_CH2, TIM4_CH1, TIM4_CH2

### Nets
3V3: J.A12 J.A13 J.A14 J.A15 J.A16 J7.B12 J7.B13 J7.B14 J8.B12 J8.B13 J8.B14 J9.B12 J9.B13 J9.B14 J10.B12 J10.B13 J10.B14
5V: J.B12 J.B13 J.B14 J7.A12 J7.A13 J7.A14 J7.A15 J7.A16 J8.A12 J8.A13 J8.A14 J8.A15 J8.A16 J9.A12 J9.A13 J9.A14 J9.A15 J9.A16 J10.A12 J10.A13 J10.A14 J10.A15 J10.A16
GND: C51.1(C1) C52.1(C1) C53.1(C1) C54.1(C1) C55.1(C1) C56.1(C1) C57.1(C1) C58.1(C1) C59.1(C1) C60.1(C1) C61.1(C1) C62.1(C1) C63.1(C1) C64.1(C1) C65.1(C1) J.B1 J.B2 J.B3 J.B4 J.B5 J.B6 J.B7 J.B8 J.B9 J.B10 J.B11 J7.B1 J7.B2 J7.B3 J7.B4 J7.B5 J7.B6 J7.B7 J7.B8 J7.B9 J7.B10 J7.B11 J8.B1 J8.B2 J8.B3 J8.B4 J8.B5 J8.B6 J8.B7 J8.B8 J8.B9 J8.B10 J8.B11 J9.B1 J9.B2 J9.B3 J9.B4 J9.B5 J9.B6 J9.B7 J9.B8 J9.B9 J9.B10 J9.B11 J10.B1 J10.B2 J10.B3 J10.B4 J10.B5 J10.B6 J10.B7 J10.B8 J10.B9 J10.B10 J10.B11
VCC: C51.2(C2) C52.2(C2) C53.2(C2) C54.2(C2) C55.2(C2) C56.2(C2) C57.2(C2) C58.2(C2) C59.2(C2) C60.2(C2) C61.2(C2) C62.2(C2) C63.2(C2) C64.2(C2) C65.2(C2) J.A1 J.A2 J.A3 J.A4 J.A5 J.A6 J.A7 J.A8 J.A9 J.A10 J.A11 J7.A1 J7.A2 J7.A3 J7.A4 J7.A5 J7.A6 J7.A7 J7.A8 J7.A9 J7.A10 J7.A11 J8.A1 J8.A2 J8.A3 J8.A4 J8.A5 J8.A6 J8.A7 J8.A8 J8.A9 J8.A10 J8.A11 J9.A1 J9.A2 J9.A3 J9.A4 J9.A5 J9.A6 J9.A7 J9.A8 J9.A9 J9.A10 J9.A11 J10.A1 J10.A2 J10.A3 J10.A4 J10.A5 J10.A6 J10.A7 J10.A8 J10.A9 J10.A10 J10.A11
PA8_GPIO: J.B16 ; port PA8_GPIO
PA9_GPIO: J.B17 ; port PA9_GPIO
PA10_GPIO: J.B18 ; port PA10_GPIO
PA11_GPIO: J.A17 ; port PA11_GPIO
PB15_GPIO: J7.B18 ; port PB15_GPIO
PC9_GPIO: J.B15 ; port PC9_GPIO
PD8_GPIO: J7.A17 ; port PD8_GPIO
PD9_GPIO: J8.B17 ; port PD9_GPIO
PD10_GPIO: J8.B18 ; port PD10_GPIO
PD15_GPIO: J8.A17 ; port PD15_GPIO
PE7_GPIO: J10.B17 ; port PE7_GPIO
PE8_GPIO: J10.B18 ; port PE8_GPIO
PE11_GPIO: J10.A17 ; port PE11_GPIO
PE12_GPIO: J7.B15 ; port PE12_GPIO
PE13_GPIO: J7.B16 ; port PE13_GPIO
PE14_GPIO: J7.B17 ; port PE14_GPIO
PG0_GPIO: J10.B15 ; port PG0_GPIO
PG1_GPIO: J10.B16 ; port PG1_GPIO
PG2_GPIO: J8.B15 ; port PG2_GPIO
PG3_GPIO: J8.B16 ; port PG3_GPIO
PG4_GPIO: J9.B15 ; port PG4_GPIO
PG5_GPIO: J9.B16 ; port PG5_GPIO
PG6_GPIO: J9.B17 ; port PG6_GPIO
PG7_GPIO: J9.B18 ; port PG7_GPIO
PG8_GPIO: J9.A17 ; port PG8_GPIO
TIM2_CH3: J10.A18 ; port TIM2_CH3
TIM3_CH1: J9.A18 ; port TIM3_CH1
TIM3_CH2: J.A18 ; port TIM3_CH2
TIM4_CH1: J7.A18 ; port TIM4_CH1
TIM4_CH2: J8.A18 ; port TIM4_CH2

### Notes on the sheet
- Motordriver Interface

### Library data of the parts
C51-C65 = CAP 0.10uF 35V: CAP CER 0.10UF 35V X7R 0603/0805; Tolerance: 10%; Package: 0603/0805; Temperature Coefficient: X7R; Operating Temperature: -55°C ~ 125°C; Value: 0.10uF
J J7-J10 = CN PCIE 36 TH: 36 Position Female Connector PCI Expressâ„¢ Gold 0.039 _1.00mm_ Black 10018784-10210TLF; MF: Amphenol ICC; Price: None; SnapEDA_Link: https://www.snapeda.com/parts/10018784-10210TLF/Amphenol%20FCI/view-part/520950/?ref=snap; Availability: Unavailable; MP: 10018784-10210TLF; Package: None; Value: *

## Sheet Mainboard_Power_Interface.SchDoc
size A4
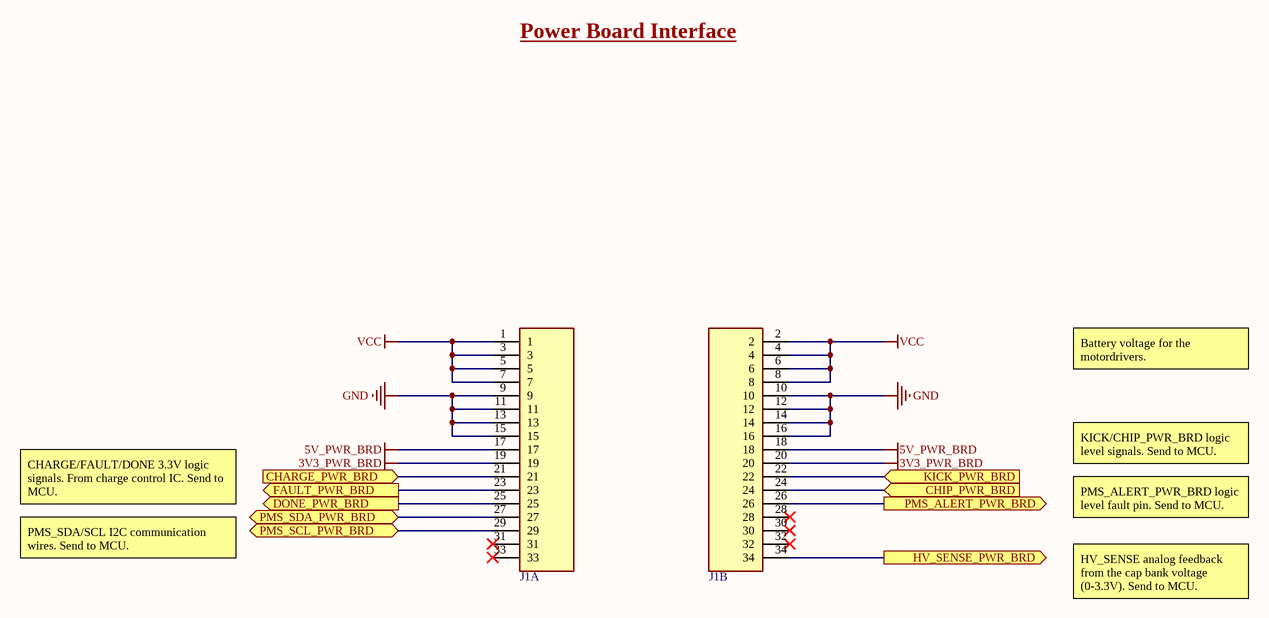
[diagram p4: Mainboard_Power_Interface.SchDoc]

### Parts
J1  0.1" Header Female 34  [SAMTEC-SSM-117-X-DV]  (value not drawn)  (parts A,B of 2)

### Ports
CHARGE_PWR_BRD (in), CHIP_PWR_BRD (in), DONE_PWR_BRD (out), FAULT_PWR_BRD (out), HV_SENSE_PWR_BRD (out), KICK_PWR_BRD (in), PMS_ALERT_PWR_BRD (out), PMS_SCL_PWR_BRD (bidir), PMS_SDA_PWR_BRD (bidir)

### Nets
3V3_PWR_BRD: J1.19 J1.20
5V_PWR_BRD: J1.17 J1.18
GND: J1.9 J1.10 J1.11 J1.12 J1.13 J1.14 J1.15 J1.16
VCC: J1.1 J1.2 J1.3 J1.4 J1.5 J1.6 J1.7 J1.8
NetJ1_21: J1.21 ; port CHARGE_PWR_BRD
NetJ1_22: J1.22 ; port KICK_PWR_BRD
NetJ1_23: J1.23 ; port FAULT_PWR_BRD
NetJ1_24: J1.24 ; port CHIP_PWR_BRD
NetJ1_25: J1.25 ; port DONE_PWR_BRD
NetJ1_26: J1.26 ; port PMS_ALERT_PWR_BRD
NetJ1_27: J1.27 ; port PMS_SDA_PWR_BRD
NetJ1_29: J1.29 ; port PMS_SCL_PWR_BRD
NetJ1_34: J1.34 ; port HV_SENSE_PWR_BRD

Not connected (* = marked no-connect by the designer): J1 28* 30* 31* 32* 33*

### Notes on the sheet
- Power Board Interface
- Battery voltage for the motordrivers.
- KICK/CHIP_PWR_BRD logic level signals. Send to MCU.
- CHARGE/FAULT/DONE 3.3V logic signals. From charge control IC. Send to MCU.
- PMS_ALERT_PWR_BRD logic level fault pin. Send to MCU.
- PMS_SDA/SCL I2C communication wires. Send to MCU.
- HV_SENSE analog feedback from the cap bank voltage (0-3.3V). Send to MCU.

### Library data of the parts
J1 = CN HDR 34POS 2x17: Female Header THRU 34POS 2ROW 0.1" (2.54mm) pitch

## Sheet Mainboard_RMII_Interface.SchDoc
size A4
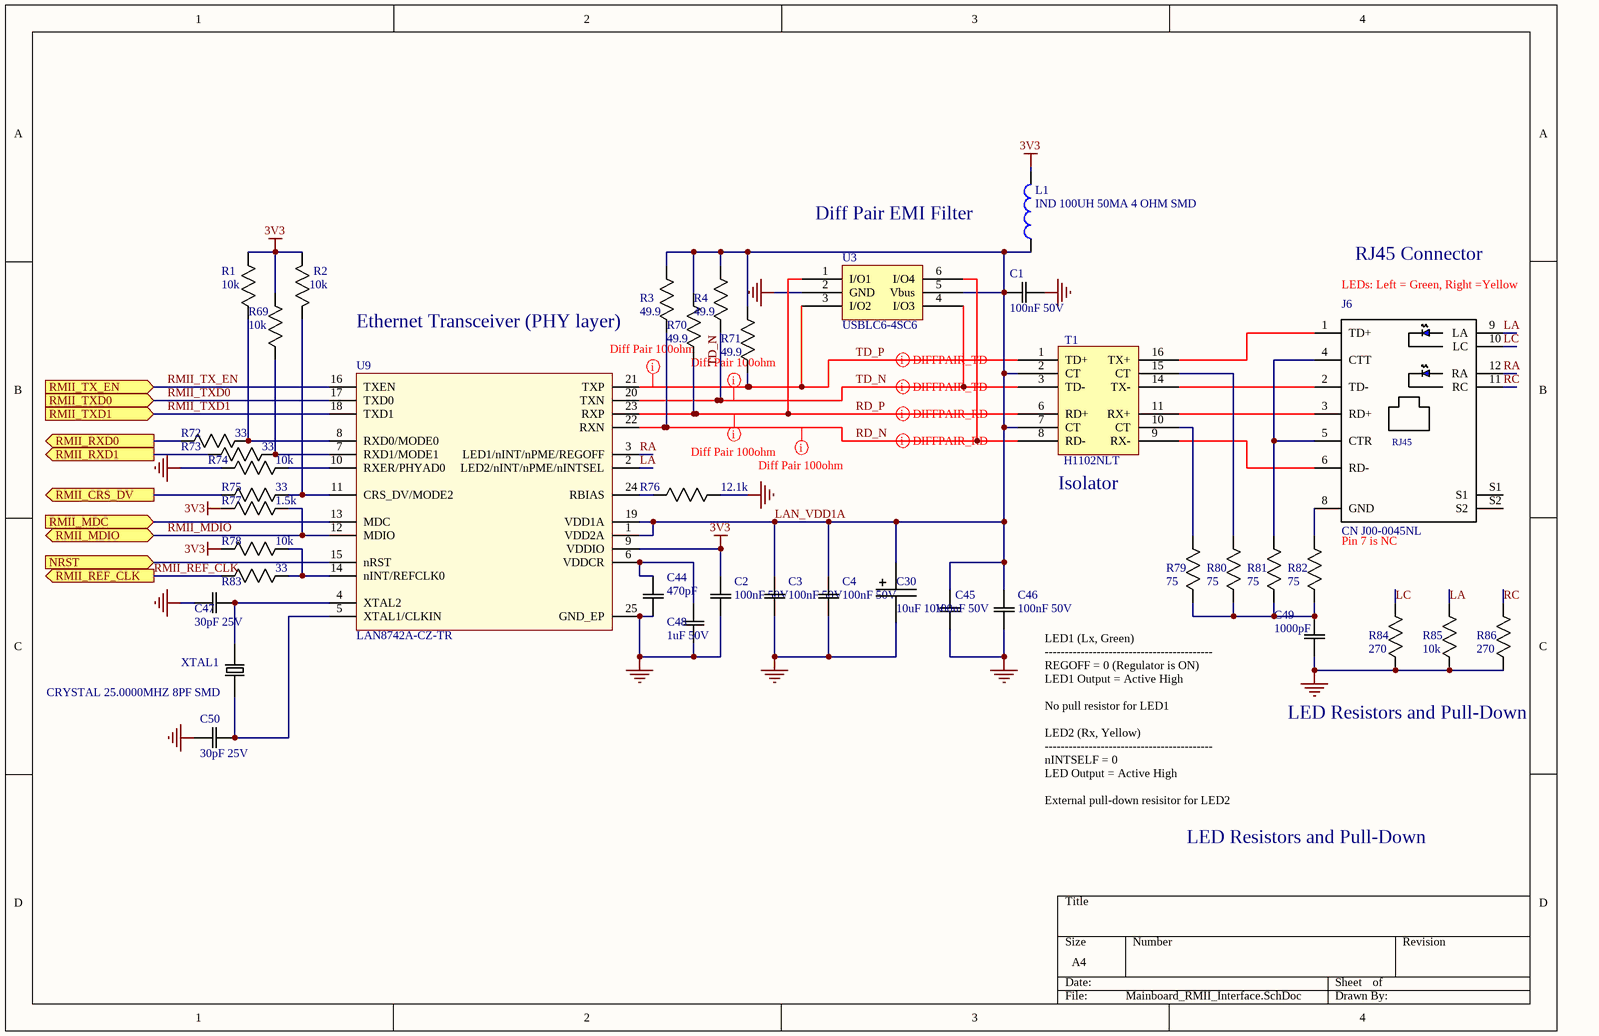
[diagram p5: Mainboard_RMII_Interface.SchDoc]

### Parts
(Parts that share a designator on the sheet are numbered #1, #2 ... from top to bottom, then left to right.)
C1#2  100nF 50V  [0805]
C2#2  100nF 50V  [0805]
C3#2  100nF 50V  [0805]
C4#2  100nF 50V  [0805]
C30#2  10uF 10V  [1206 Polarized]
C44  470pF  [0805]
C45  100nF 50V  [0805]
C46  100nF 50V  [0805]
C47  30pF 25V  [0805]
C48  1uF 50V  [0805]
C49  1000pF  [0603]
C50  30pF 25V  [0805]
J6  CN J00-0045NL  [RJ45 J00-0045NL]
L1  IND 100UH 50MA 4 OHM SMD  [0805]
R1#2  10k  [0805]
R2#2  10k  [0805]
R3#2  49.9  [0805]
R4#2  49.9  [0805]
R69  10k  [0805]
R70  49.9  [0805]
R71  49.9  [0805]
R72  33  [0805]
R73  33  [0805]
R74  10k  [0805]
R75  33  [0805]
R76  12.1k  [0805]
R77  1.5k  [0805]
R78  10k  [0805]
R79  75  [0805]
R80  75  [0805]
R81  75  [0805]
R82  75  [0805]
R83  33  [0805]
R84  270  [0805]
R85  10k  [0805]
R86  270  [0805]
T1  H1102NLT  [TRANSFORMER]
U3#2  USBLC6-4SC6  [SOT23-6L]
U9  LAN8742A-CZ-TR  [24-QFN (4x4)]
XTAL1#2  CRYSTAL 25.0000MHZ 8PF SMD  [SMD-2]

### Ports
NRST (in), RMII_CRS_DV (out), RMII_MDC (in), RMII_MDIO (bidir), RMII_REF_CLK (out), RMII_RXD0 (out), RMII_RXD1 (out), RMII_TX_EN (in), RMII_TXD0 (in), RMII_TXD1 (in)

### Nets
3V3: C2#2.2(C2) L1.2 R1#2.1(R1) R2#2.1(R1) R69.1(R1) R77.2(R2) R78.2(R2) U9.9(VDDIO)
GND: C1#2.2(C2) C2#2.1(C1) C3#2.1(C1) C4#2.1(C1) C30#2.2(P$2) C44.1(C1) C45.1(C1) C46.1(C1) C47.1(C1) C48.1(C1) C49.1(C1) C50.1(C1) R74.2(R2) R76.1(R1) R84.2(R2) R85.2(R2) R86.2(R2) U3#2.2(GND) U9.25(GND_EP)
LA: J6.9(LA) R85.1(R1) U9.2(LED2/nINT/nPME/nINTSEL)
LAN_VDD1A: C1#2.1(C1) C3#2.2(C2) C4#2.2(C2) C30#2.1(P$1) C45.2(C2) C46.2(C2) L1.1 R3#2.1(R1) R4#2.1(R1) R70.1(R1) R71.1(R1) T1.2(CT) T1.7(CT) U3#2.5(Vbus) U9.1(VDD2A) U9.19(VDD1A)
LC: J6.10(LC) R84.1(R1)
NRST: U9.15(nRST) ; port NRST
RA: J6.12(RA) U9.3(LED1/nINT/nPME/REGOFF)
RC: J6.11(RC) R86.1(R1)
RD_N: R3#2.2(R2) T1.8(RD-) U3#2.6(I/O4) U9.22(RXN)
RD_P: R70.2(R2) T1.6(RD+) U3#2.1(I/O1) U9.23(RXP)
RMII_MDIO: R77.1(R1) U9.12(MDIO) ; port RMII_MDIO
RMII_REF_CLK: R83.2(R2) ; port RMII_REF_CLK
RMII_TX_EN: U9.16(TXEN) ; port RMII_TX_EN
RMII_TXD0: U9.17(TXD0) ; port RMII_TXD0
RMII_TXD1: U9.18(TXD1) ; port RMII_TXD1
TD_N: R4#2.2(R2) T1.3(TD-) U3#2.4(I/O3) U9.20(TXN)
TD_P: R71.2(R2) T1.1(TD+) U3#2.3(I/O2) U9.21(TXP)
NetC44_2: C44.2(C2) C48.2(C2) U9.6(VDDCR)
NetC47_2: C47.2(C2) U9.4(XTAL2) XTAL1#2.2
NetC49_2: C49.2(C2) R79.2(R2) R80.2(R2) R81.2(R2) R82.2(R2)
NetC50_2: C50.2(C2) U9.5(XTAL1/CLKIN) XTAL1#2.1
NetJ6_1: J6.1(TD+) T1.16(TX+)
NetJ6_2: J6.2(TD-) T1.14(TX-)
NetJ6_3: J6.3(RD+) T1.11(RX+)
NetJ6_4: J6.4(CTT) J6.5(CTR) R81.1(R1)
NetJ6_6: J6.6(RD-) T1.9(RX-)
NetJ6_8: J6.8(GND) R82.1(R1)
NetR1#2_2: R1#2.2(R2) R72.1(R1) U9.8(RXD0/MODE0)
NetR2#2_2: R2#2.2(R2) R75.1(R1) U9.11(CRS_DV/MODE2)
NetR69_2: R69.2(R2) R73.1(R1) U9.7(RXD1/MODE1)
NetR72_2: R72.2(R2) ; port RMII_RXD0
NetR73_2: R73.2(R2) ; port RMII_RXD1
NetR74_1: R74.1(R1) U9.10(RXER/PHYAD0)
NetR75_2: R75.2(R2) ; port RMII_CRS_DV
NetR76_2: R76.2(R2) U9.24(RBIAS)
NetR78_1: R78.1(R1) R83.1(R1) U9.14(nINT/REFCLK0)
NetR79_1: R79.1(R1) T1.10(CT)
NetR80_1: R80.1(R1) T1.15(CT)
NetU9_13: U9.13(MDC) ; port RMII_MDC

Not connected (* = marked no-connect by the designer): J6 S1 S2

### Layout directives
differential pair: RD_N, RD_P, TD_N, TD_P
rule Matched Net Lengths [Tolerance = 100mil]: RD_N, RD_P, TD_N, TD_P

### Notes on the sheet
- (near L1) Diff Pair EMI Filter
- (near J6) LEDs: Left = Green, Right =Yellow
- RJ45 Connector
- (near R3#2) Ethernet Transceiver (PHY layer)
- (near T1) Isolator
- Pin 7 is NC
- LED Resistors and Pull-Down
- LED1 (Lx, Green)
  ------------------------------------------
  REGOFF = 0 (Regulator is ON)
  LED1 Output = Active High
  No pull resistor for LED1
  LED2 (Rx, Yellow)
  ------------------------------------------
  nINTSELF = 0
  LED Output = Active High
  External pull-down resisitor for LED2
- (in symbol CN MAGJACK) RJ45

### Library data of the parts
C1#2 C2#2 C3#2 C4#2 C45 C46 = CAP 100nF 50V: as C30#1 on sheet Mainboard_MCU_Func; Package: 0805; Value: 100nF; Rating: 50V
C30#2 = CAP TANT 10uF 10V: CAP TANT 10UF 10V 1206; Tolerance: 10%; ESR (Equivalent Series Resistance): 3.8 Ohm; Type: Molded Tantalum; Package: 1206; Value: 10uF; Rating: 10V; Operating Temperature: -55°C ~ 125°C
C44 = CAP 470pF 50V: CAP CER 470PF 50V X7R 0603/0805; Tolerance: 10%; Package: 0603/0805; Value: 470pF; Rating: 50V; Temperature Coefficient: X7R; Operating Temperature: -55°C ~ 125°C
C47 C50 = CAP 30pF 25V: CAP CER 30PF 25V NP0 0805; Tolerance: 20%; Package: 0805; Value: 30pF; Rating: 25V
C48 = CAP 1uF 50V: CAP CER 1UF 50V X7R 0805; Tolerance: 10%; Package: 0805; Value: 1uF; Rating: 50V; Temperature Coefficient: X7R; Operating Temperature: -55°C ~ 125°C
C49 = CAP 1000pF 50V: CAP CER 1000PF 50V X7R 0603/0805; Tolerance: 10%; Package: 0603/0805; Value: 1000pF; Rating: 50V; Temperature Coefficient: X7R; Operating Temperature: -55°C ~ 125°C
J6 = CN MAGJACK: CN MAGJACK 1PORT 100 BASE-TX; MF: Pulse Electronics; Package: None; SnapEDA_Link: https://www.snapeda.com/parts/J00-0045NL/Pulse%20Electronics%20Network/view-part/87956/?ref=snap; MP: J00-0045NL; Value: *; Digikey Link: https://www.digikey.com/product-detail/en/pulse-electronics-network/J00-0045NL/553-1619-5-ND/1036860?utm_source=snapeda&utm_medium=aggregator&utm_campaign=symbol; Digikey: 553-1619-5-ND; Supplier 1: Mouser; Supplier Part Number 1: 673-J00-0045NL
L1 = IND 100UH 50MA 4 OHM SMD: 100µH Unshielded Wirewound Inductor 50mA 4Ohm 0805 (2012 Metric); MF: Taiyo Yuden; MP: LBR2012T101K; Revision: July-2002: Re-released for DXP Platform.; Value: 100uH; Digikey: 587-2048-1-ND; Digikey Link: https://www.digikey.ca/product-detail/en/taiyo-yuden/LBR2012T101K/587-2048-1-ND/1788995; Supplier 1: Digi-Key; Supplier Part Number 1: 587-4040-1-ND
R1#2 R2#2 R69 R74 R78 R85 = RES 10k 1/8W - 1%: RES SMD 10K OHM 1% 1/8W 0805; Power (Watts): 0.125W; Package: 0805; Value: 10k; Tolerance: 1%
R3#2 R4#2 R70 R71 = RES 49.9 1/8W: RES SMD 49.9 OHM 1% 1/8W 0805; Power (Watts): 0.125W; Package: 0805; Value: 49.9; Tolerance: 1%
R72 R73 R75 R83 = RES 33.0 1/8W - 1%: RES SMD 33 OHM 1% 1/8W 0805; Power (Watts): 0.125W; Package: 0805; Value: 33; Tolerance: 1%
R76 = RES 12.1k 1/8W: RES SMD 12.1K OHM 1% 1/8W 0805; Power (Watts): 0.125W; Package: 0805; Value: 12.1k; Tolerance: 1%
R77 = RES 1.5k 1/8W - 1%: RES SMD 1.5K OHM 1% 1/8W 0805; Power (Watts): 0.125W; Package: 0805; Value: 1.5k; Tolerance: 1%; ComponentLink1Description: digikey; ComponentLink1URL: https://www.digikey.ca/en/products/detail/panasonic-electronic-components/ERJ-6ENF1022V/111476
R79-R82 = RES 75.0 1/8W - 1%: RES SMD 75 OHM 1% 1/8W 0805; Power (Watts): 0.125W; Package: 0805; Value: 75; Tolerance: 1%
R84 R86 = RES 270.0 1/8W: RES SMD 270 OHM 5% 1/8W 0805; Power (Watts): 0.125W; Package: 0805; Value: 270; Tolerance: 5%
T1 = XFRMR H1102NLT: Isolation and Data Interface (Encapsulated) Pulse Transformer 1:1 Transmitter, 1:1 Receiver Surface Mount; MF: Pulse Electronics; Package: SOIC-16; Price: 7.99 CAD; MP: H1102NL; Digikey: 553-1323-5-ND; Digikey Link: https://www.digikey.ca/en/products/detail/pulse-electronics-network/H1102NL/1036940?s=N4IgTCBcDaIBIEYEAYwDkAyIC6BfIA; Supplier 1: Digi-Key; Supplier Part Number 1: 553-1323-5-ND
U9 = LAN8742A-CZ-TR: LAN8742A-CZ-TR - Small Footprint RMII 10/100 Ethernet, Transceiver with HP Auto-MDIX and flexPWR Technology SQFN-24; MF: Microchip Technology; MP: LAN8742A-CZ-TR; Digikey: LAN8742A-CZ-CT-ND; Digikey Link: https://www.digikey.ca/product-detail/en/microchip-technology/LAN8742A-CZ-TR/LAN8742A-CZ-CT-ND/8256089; Supplier 1: Digi-Key; Supplier Part Number 1: LAN8742A-CZ-CT-ND
XTAL1#2 = XTAL 25MHZ 8PF SMD: as XTAL1#1 on sheet Mainboard_MCU_Func; Package: 2-SMD, No Lead; Price: 0.95 CAD; Frequency: 25MHz; Digikey: 644-1041-1-ND; Digikey Link: https://www.digikey.ca/product-detail/en/ndk-america-inc/NX5032GA-25.000000MHZ-LN-CD-1/644-1041-1-ND/1128913; Load Capacitance: 8pF; Supplier 1: Digi-Key; Supplier Part Number 1: 644-1041-1-ND

## Sheet Mainboard_Wifi_Interface.SchDoc
size A4
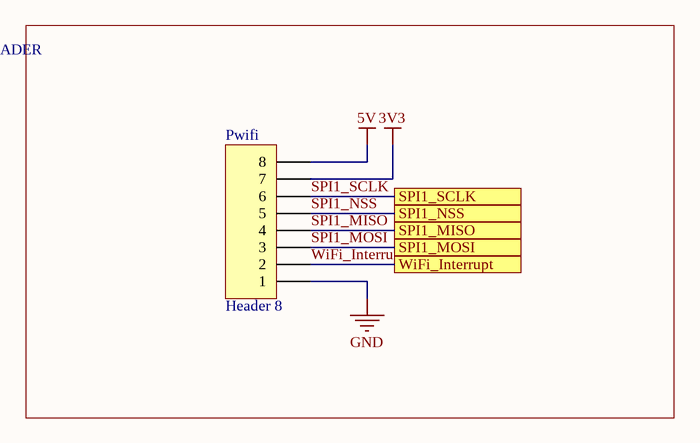
[diagram p6: Mainboard_Wifi_Interface.SchDoc]

### Parts
Pwifi  Header 8  [HDR1X8]

### Blocks framed on the sheet
WIFI INTERFACE HEADER: Pwifi

### Ports
SPI1_MISO, SPI1_MOSI, SPI1_NSS, SPI1_SCLK, WiFi_Interrupt

### Nets
3V3: Pwifi.7
5V: Pwifi.8
GND: Pwifi.1
SPI1_MISO: Pwifi.4 ; port SPI1_MISO
SPI1_MOSI: Pwifi.3 ; port SPI1_MOSI
SPI1_NSS: Pwifi.5 ; port SPI1_NSS
SPI1_SCLK: Pwifi.6 ; port SPI1_SCLK
WiFi_Interrupt: Pwifi.2 ; port WiFi_Interrupt

### Library data of the parts
Pwifi = Header 8: Header, 8-Pin; LatestRevisionDate: 17-Jul-2002; LatestRevisionNote: Re-released for DXP Platform.; Publisher: Altium Limited

## Sheet Mainboard_Breakbeam_Interface.SchDoc
size A4
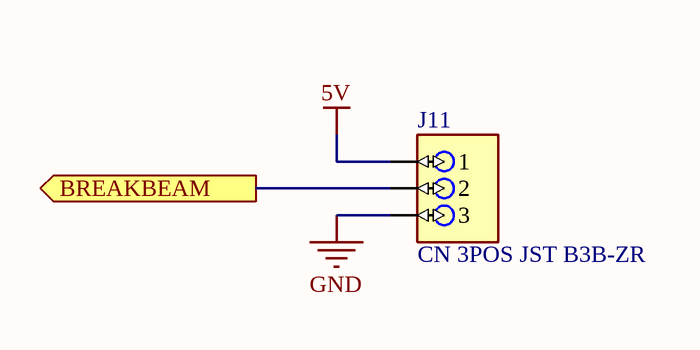
[diagram p7: Mainboard_Breakbeam_Interface.SchDoc]

### Parts
J11  CN 3POS JST B3B-ZR  [CN 3POS JST B3B-ZR]

### Ports
BREAKBEAM (out)

### Nets
5V: J11.1
GND: J11.3
NetJ11_2: J11.2 ; port BREAKBEAM

### Library data of the parts
J11 = CN 3POS JST B3B-ZR: Connector Header Through Hole 3 position 0.059 (1.50mm); MF: JST Sales; Price: $0.18; MP: B3B-ZR; Package: Bulk; Check_prices: https://www.snapeda.com/parts/B3B-ZR/JST%20Sales%20America%20Inc./view-part/496625/?ref=eda; SnapEDA_Link: https://www.snapeda.com/parts/B3B-ZR/JST%20Sales%20America%20Inc./view-part/496625/?ref=snap; Value: *; Availability: Active; ComponentLink1Description: Digikey Link; ComponentLink1URL: https://www.digikey.com/en/products/detail/jst-sales-america-inc/B3B-ZR(LF)(SN)/926565?utm_source=snapeda&utm_medium=aggregator&utm_campaign=buynow

## Sheet MainBoard_MCU_Power.SchDoc
size B
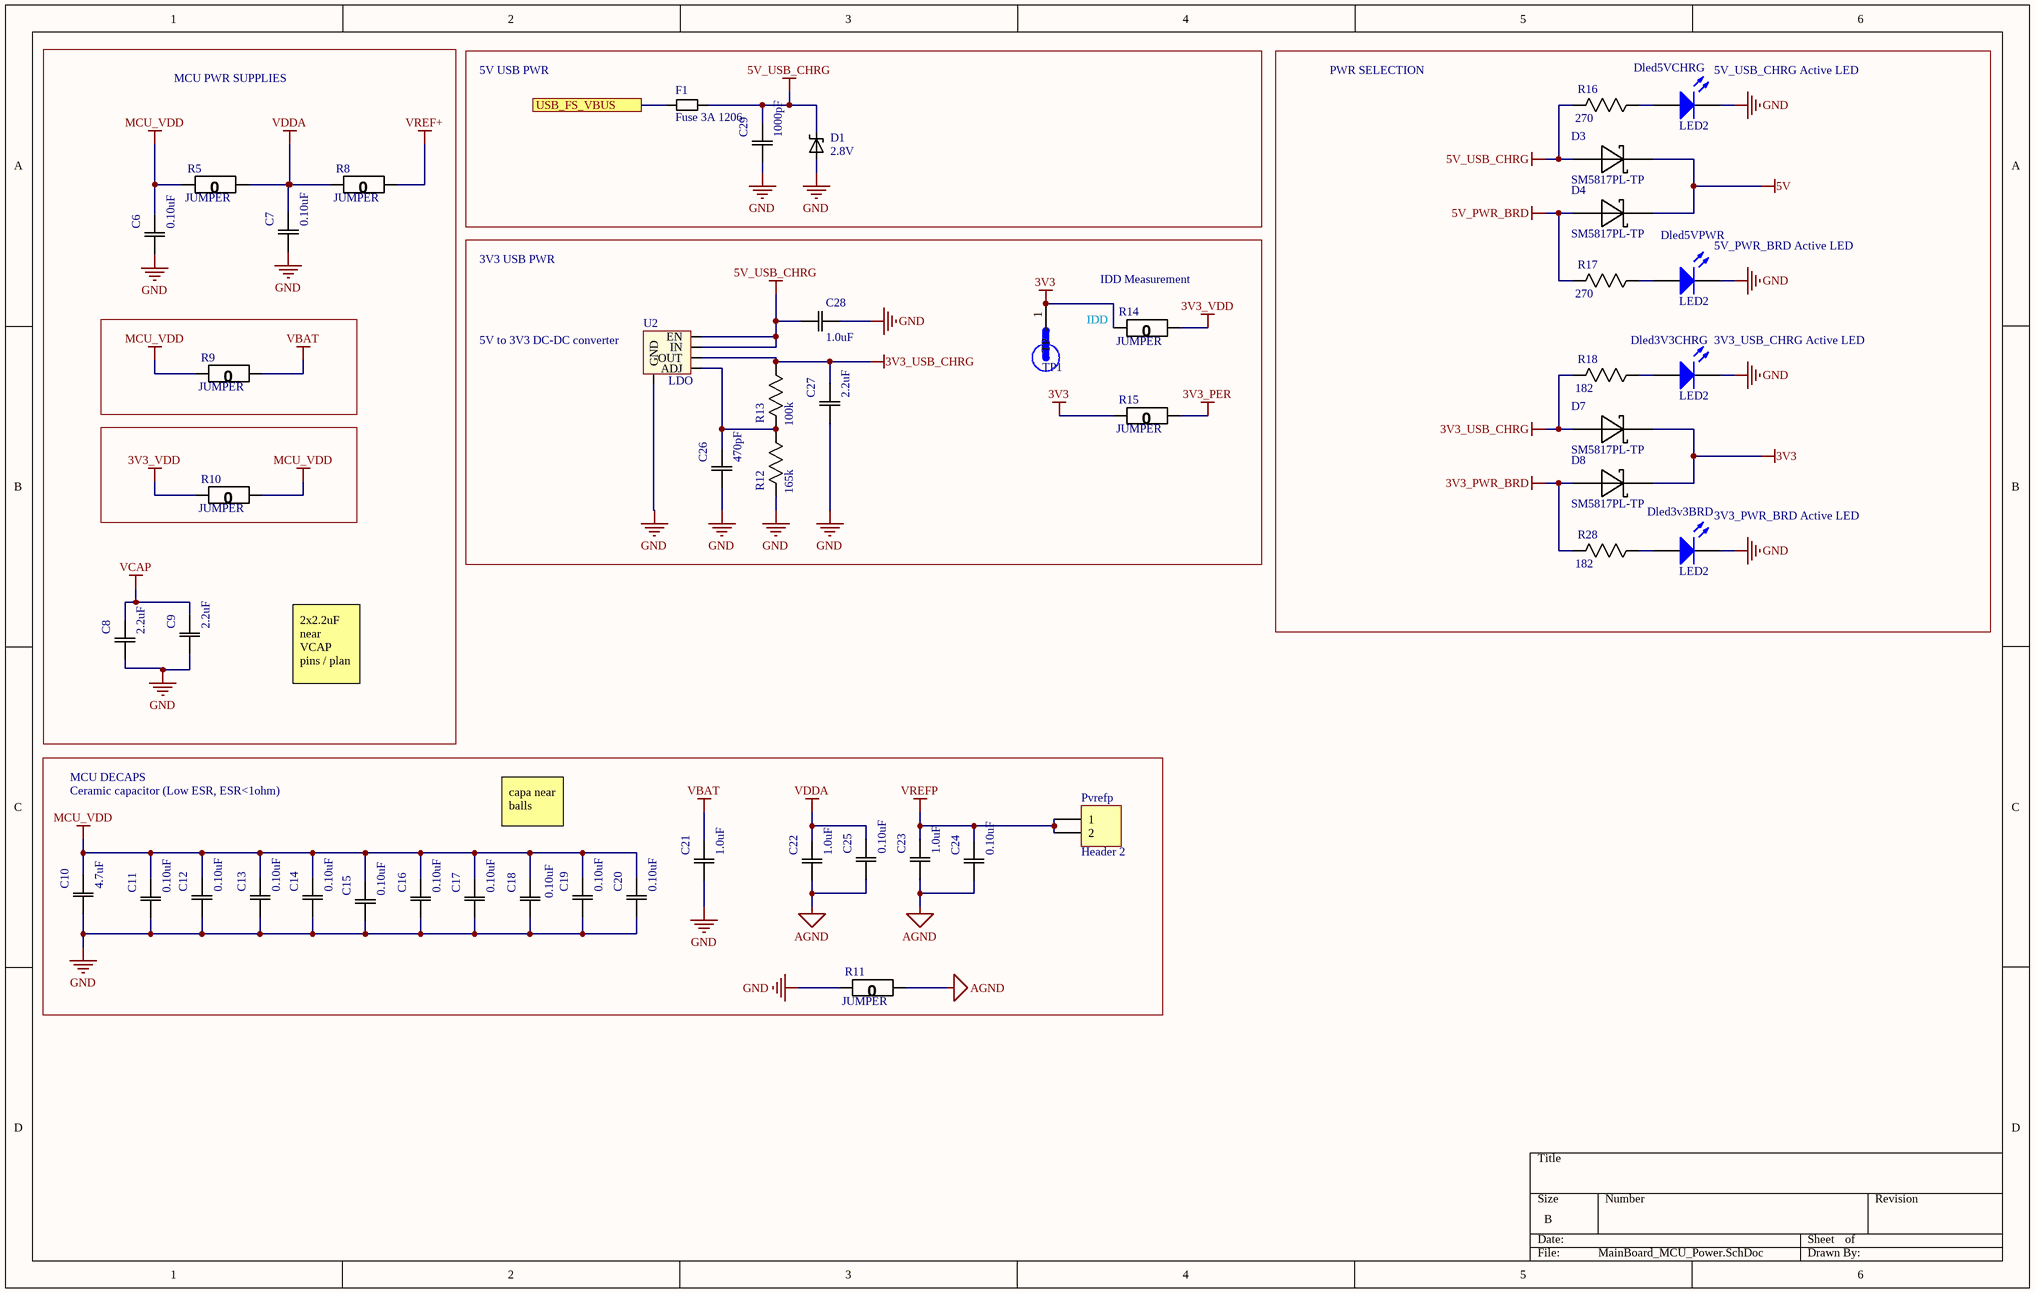
[diagram p8: MainBoard_MCU_Power.SchDoc]

### Parts
C6  0.10uF  [0603]
C7  0.10uF  [0603]
C8  2.2uF  [0603]
C9  2.2uF  [0603]
C10  4.7uF  [0603]
C11  0.10uF  [0603]
C12  0.10uF  [0603]
C13  0.10uF  [0603]
C14  0.10uF  [0603]
C15  0.10uF  [0603]
C16  0.10uF  [0603]
C17  0.10uF  [0603]
C18  0.10uF  [0603]
C19  0.10uF  [0603]
C20  0.10uF  [0603]
C21  1.0uF  [0603]
C22  1.0uF  [0603]
C23  1.0uF  [0603]
C24  0.10uF  [0603]
C25  0.10uF  [0603]
C26  470pF  [0603]
C27  2.2uF  [0603]
C28  1.0uF  [0603]
C29  1000pF  [0603]
D1  2.8V  [SOD-123]
D3  SM5817PL-TP  [SOD-123]
D4  SM5817PL-TP  [SOD-123]
D7  SM5817PL-TP  [SOD-123]
D8  SM5817PL-TP  [SOD-123]
Dled3v3BRD  LED2  [3.2X1.6X1.1]
Dled3V3CHRG  LED2  [3.2X1.6X1.1]
Dled5VCHRG  LED2  [3.2X1.6X1.1]
Dled5VPWR  LED2  [3.2X1.6X1.1]
F1  Fuse 3A 1206  [1206]
Pvrefp  Header 2  [HDR1X2]
R5  JUMPER  [0805]
R8  JUMPER  [0805]
R9  JUMPER  [0805]
R10  JUMPER  [0805]
R11  JUMPER  [0805]
R12  165k  [0805]
R13  100k  [0805]
R14  JUMPER  [0805]
R15  JUMPER  [0805]
R16  270  [0805]
R17  270  [0805]
R18  182  [0805]
R28  182  [0805]
TP1  Test Point - 5019  [TP380X203]  (value not drawn)
U2  LDO  [REG LIN POS ADJ 500MA 8SOIC]

### Blocks framed on the sheet
MCU PWR SUPPLIES: C6-C9 R5 R8-R10
5V USB PWR: C29 D1 F1

### Ports
USB_FS_VBUS

### Nets
3V3: D7.C(K) D8.C(K) R14.2(R2) R15.2(R2) TP1.1(TP)
3V3_PER: R15.1(R1)
3V3_PWR_BRD: D8.A R28.2(R2)
3V3_USB_CHRG: C27.2(C2) D7.A R13.1(R1) R18.2(R2) U2.OUT
3V3_VDD: R10.2(R2) R14.1(R1)
5V: D3.C(K) D4.C(K)
5V_PWR_BRD: D4.A R17.2(R2)
5V_USB_CHRG: C28.1(C1) C29.2(C2) D1.C D3.A F1.2 R16.2(R2) U2.EN U2.IN
AGND: C22.1(C1) C23.1(C1) C24.1(C1) C25.1(C1) R11.1(R1)
GND: C6.1(C1) C7.1(C1) C8.1(C1) C9.1(C1) C10.1(C1) C11.1(C1) C12.1(C1) C13.1(C1) C14.1(C1) C15.1(C1) C16.1(C1) C17.1(C1) C18.1(C1) C19.1(C1) C20.1(C1) C21.1(C1) C26.1(C1) C27.1(C1) C28.2(C2) C29.1(C1) D1.A Dled3v3BRD.2(K) Dled3V3CHRG.2(K) Dled5VCHRG.2(K) Dled5VPWR.2(K) R11.2(R2) R12.2(R2) U2.GND
MCU_VDD: C6.2(C2) C10.2(C2) C11.2(C2) C12.2(C2) C13.2(C2) C14.2(C2) C15.2(C2) C16.2(C2) C17.2(C2) C18.2(C2) C19.2(C2) C20.2(C2) R5.2(R2) R9.2(R2) R10.1(R1)
VBAT: C21.2(C2) R9.1(R1)
VCAP: C8.2(C2) C9.2(C2)
VDDA: C7.2(C2) C22.2(C2) C25.2(C2) R5.1(R1) R8.2(R2)
VREF+: R8.1(R1)
VREFP: C23.2(C2) C24.2(C2) Pvrefp.1 Pvrefp.2
NetC26_2: C26.2(C2) R12.1(R1) R13.2(R2) U2.ADJ
NetDled3v3BRD_1: Dled3v3BRD.1(A) R28.1(R1)
NetDled3V3CHRG_1: Dled3V3CHRG.1(A) R18.1(R1)
NetDled5VCHRG_1: Dled5VCHRG.1(A) R16.1(R1)
NetDled5VPWR_1: Dled5VPWR.1(A) R17.1(R1)
NetF1_1: F1.1 ; port USB_FS_VBUS

### Notes on the sheet
- PWR SELECTION
- (near Dled5VCHRG) 5V_USB_CHRG Active LED
- 3V3 USB PWR
- (near R14) IDD Measurement
- (near Dled5VPWR) 5V_PWR_BRD Active LED
- (near U2) 5V to 3V3 DC-DC converter
- (near R14) IDD
- (near Dled3V3CHRG) 3V3_USB_CHRG Active LED
- (near Dled3v3BRD) 3V3_PWR_BRD Active LED
- 2x2.2uF near VCAP pins / plan
- MCU DECAPS
- Ceramic capacitor (Low ESR, ESR<1ohm)
- capa near balls

### Library data of the parts
C6 C7 C11-C20 C24 C25 = CAP 0.10uF 16V: CAP CER 0.10UF 16V X5R 0603/0805; Tolerance: 10%; Package: 0603/0805; Value: 0.10uF; Rating: 16V; Temperature Coefficient: X5R; Operating Temperature: -55°C ~ 85°C
C8 C9 C27 = CAP 2.2uF 16V: CAP CER 2.2UF 16V X5R 0603/0805; Tolerance: 10%; Package: 0603/0805; Value: 2.2uF; Rating: 16V; Temperature Coefficient: X5R; Operating Temperature: -55°C ~ 85°C
C10 = CAP 4.7uF 16V: CAP CER 4.7UF 16V X5R 0603/0805; Tolerance: 10%; Package: 0603/0805; Value: 4.7uF; Rating: 16V; Temperature Coefficient: X5R; Operating Temperature: -55°C ~ 85°C
C21-C23 C28 = CAP 1.0uF 16V: CAP CER 1.0UF 16V X5R 0603/0805; Tolerance: 10%; Package: 0603/0805; Value: 1.0uF; Rating: 16V; Temperature Coefficient: X5R; Operating Temperature: -55°C ~ 85°C
C26 = CAP 470pF 16V: CAP CER 470PF 16V X5R 0603/0805; Tolerance: 10%; Package: 0603/0805; Value: 470pF; Rating: 16V; Temperature Coefficient: X5R; Operating Temperature: -55°C ~ 85°C
C29 = CAP 1000pF 16V: CAP CER 1000PF 16V X5R 0603/0805; Tolerance: 10%; Package: 0603/0805; Value: 1000pF; Rating: 16V; Temperature Coefficient: X5R; Operating Temperature: -55°C ~ 85°C
D1 = DIODE ZENER 2.8V 500mW: Zener Diode 2.8V 500mW ±5% Surface Mount SOD-123; Impedance (Max) (Zzt): 30 Ohms; Current - Reverse Leakage @ Vr: 75µA @ 1V; Voltage - Forward (Vf) (Max) @ If: 900mV @ 10mA; ComponentLink1Description: digikey; ComponentLink1URL: https://www.digikey.ca/en/products/detail/micro-commercial-co/MMSZ5245B-TP/1793206; Power - Max: 500mW; Voltage - Zener (Nom) (Vz): 2.8V
D3 D4 D7 D8 = DIODE SCHOTTKY 20V 1A: Diode Schottky 20V 1A Surface Mount SOD-123FL; MF: Micro Commercial Co; ComponentLink1Description: digikey; ComponentLink1URL: https://www.digikey.ca/product-detail/en/on-semiconductor/MBR0540T1G/MBR0540T1GOSCT-ND/917967; Digikey: SM5817PL-TPMSCT-ND; Digikey Link: https://www.digikey.ca/product-detail/en/micro-commercial-co/SM5817PL-TP/SM5817PL-TPMSCT-ND/1793410; MP: SM5817PL-TP; Voltage Rating: 20V; Package: SOD-123; Current Rating: 1A
Dled3v3BRD Dled3V3CHRG Dled5VCHRG Dled5VPWR = LED GREEN SMD: Typical RED, GREEN, YELLOW, AMBER GaAs LED; Voltage - Forward (Vf) (Typ): 2V; Lens Transparency: Clear; Current - Test: 20mA; Package: 1206; Color: Green
F1 = FUSE 3A 63V SLOW: FUSE 3A 63V AC/DC SLOW 1206; Response Time: Slow Blow; Current Rating (Amps): 3A; Operating Temperature: -55°C ~ 90°C; Voltage Rating - AC: 63V; Voltage Rating - DC: 63V
Pvrefp = Header 2: Header, 2-Pin; LatestRevisionDate: 17-Jul-2002; LatestRevisionNote: Re-released for DXP Platform.; Publisher: Altium Limited
R5 R8-R11 R14 R15 = RES 0 JUMPER: as R1#1 on sheet Mainboard_MCU_Func; Package: 0805
R12 = RES 165k 1/4W: RES SMD 165K OHM 1% 1/4W 0805; Power (Watts): 0.25W; Package: 0805; Value: 165k; Tolerance: 1%
R13 = RES 100k 1/8W - 1%: as R7 on sheet Mainboard_Encoder_Interface; Package: 0805; Value: 100k; Tolerance: 1%
R16 R17 = RES 270.0 1/8W: as R84 on sheet Mainboard_RMII_Interface; Package: 0805; Value: 270; Tolerance: 5%
R18 R28 = RES 182.0 1/8W: RES SMD 182 OHM 1% 1/8W 0805; Power (Watts): 0.125W; Package: 0805; Value: 182; Tolerance: 1%
TP1 = Test Point - 5019: PC Test Point, Miniature Phosphor Bronze, Silver Plating Surface Mount Mounting Type; MP: 5019; MF: Keystone Electronics; Value: *; Package: 2010 Keystone; Digi-Key_Part_Number: 36-5019CT-ND; Digi-Key_Purchase_URL: https://www.digikey.com/product-detail/en/keystone-electronics/5019/36-5019CT-ND/3907344?utm_source=snapeda&utm_medium=aggregator&utm_campaign=symbol
U2 = REG LIN POS ADJ: Linear Voltage Regulator IC  1 Output  500mA 8-SOIC; MF: Texas Instruments; MP: TL5209DR; Digikey: 296-21569-1-ND; Digikey Link: https://www.digikey.ca/product-detail/en/texas-instruments/TL5209DR/296-21569-1-ND/1427137; Price: 1.548 CAD; Rating: 500mA; Package: 8 SOIC; Supplier 1: Digi-Key; Supplier Part Number 1: 296-21569-1-ND

## Sheet Mainboard_Debug_Interface.SchDoc
size A4
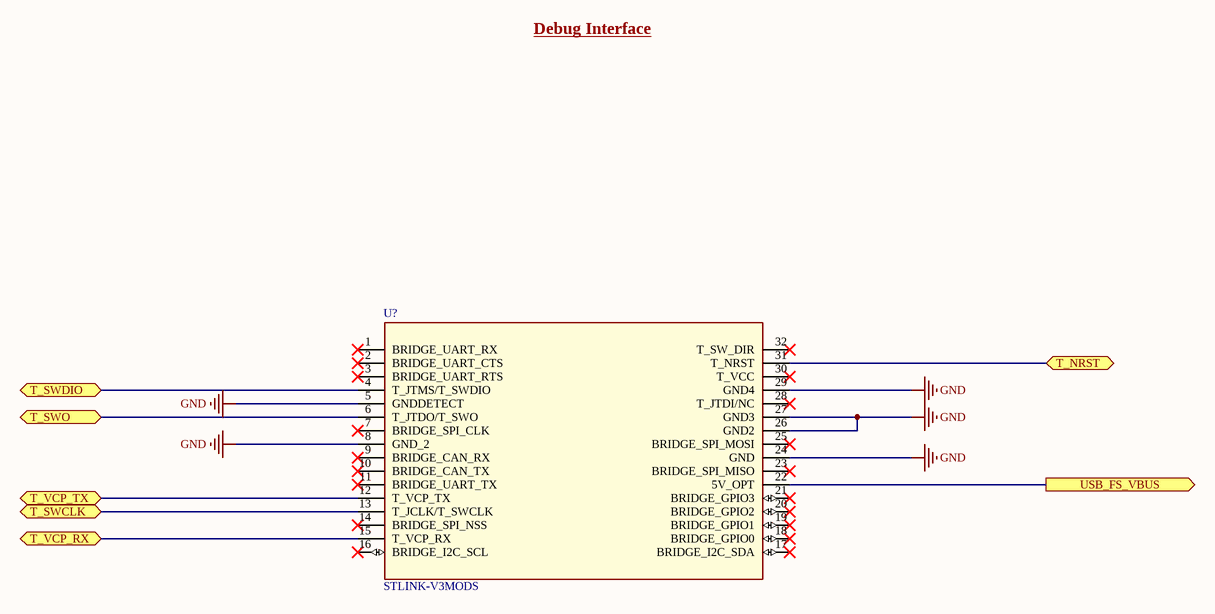
[diagram p9: Mainboard_Debug_Interface.SchDoc]

### Parts
U?  STLINK-V3MODS  [STLINK-V3MODS]

### Ports
T_NRST (bidir), T_SWCLK (bidir), T_SWDIO (bidir), T_SWO (bidir), T_VCP_RX (bidir), T_VCP_TX (bidir), USB_FS_VBUS (out)

### Nets
GND: U?.5(GNDDETECT) U?.8(GND_2) U?.24(GND) U?.26(GND2) U?.27(GND3) U?.29(GND4)
NetF1_1: U?.22(5V_OPT) ; port USB_FS_VBUS
NetU?_4: U?.4(T_JTMS/T_SWDIO) ; port T_SWDIO
NetU?_6: U?.6(T_JTDO/T_SWO) ; port T_SWO
NetU?_12: U?.12(T_VCP_TX) ; port T_VCP_TX
NetU?_13: U?.13(T_JCLK/T_SWCLK) ; port T_SWCLK
NetU?_15: U?.15(T_VCP_RX) ; port T_VCP_RX
NetU?_31: U?.31(T_NRST) ; port T_NRST

Not connected (* = marked no-connect by the designer): U? 1(BRIDGE_UART_RX)* 2(BRIDGE_UART_CTS)* 3(BRIDGE_UART_RTS)* 7(BRIDGE_SPI_CLK)* 9(BRIDGE_CAN_RX)* 10(BRIDGE_CAN_TX)* 11(BRIDGE_UART_TX)* 14(BRIDGE_SPI_NSS)* 16(BRIDGE_I2C_SCL)* 17(BRIDGE_I2C_SDA)* 18(BRIDGE_GPIO0)* 19(BRIDGE_GPIO1)* 20(BRIDGE_GPIO2)* 21(BRIDGE_GPIO3)* 23(BRIDGE_SPI_MISO)* 25(BRIDGE_SPI_MOSI)* 28(T_JTDI/NC)* 30(T_VCC)* 32(T_SW_DIR)*

### Notes on the sheet
- Debug Interface

### Library data of the parts
U? = STLINK-V3MODS: STM32 - Debugger, Programmer (In-Circuit/In-System); MF: STMicroelectronics; MP: STLINK-V3MODS; Price: $12.15; ComponentLink1Description: Digikey; ComponentLink1URL: https://www.digikey.ca/en/products/detail/stmicroelectronics/stlink-v3mods/11610874; ComponentLink2Description: SnapEDA; ComponentLink2URL: https://www.snapeda.com/parts/STLINK-V3MODS/STMicroelectronics/view-part/; ComponentLink3Description: Datasheet; ComponentLink3URL: https://www.st.com/resource/en/data_brief/stlink-v3mods.pdf; Digikey PN: 497-STLINK-V3MODS-ND